# Altium project CoproMKII.PrjPcb
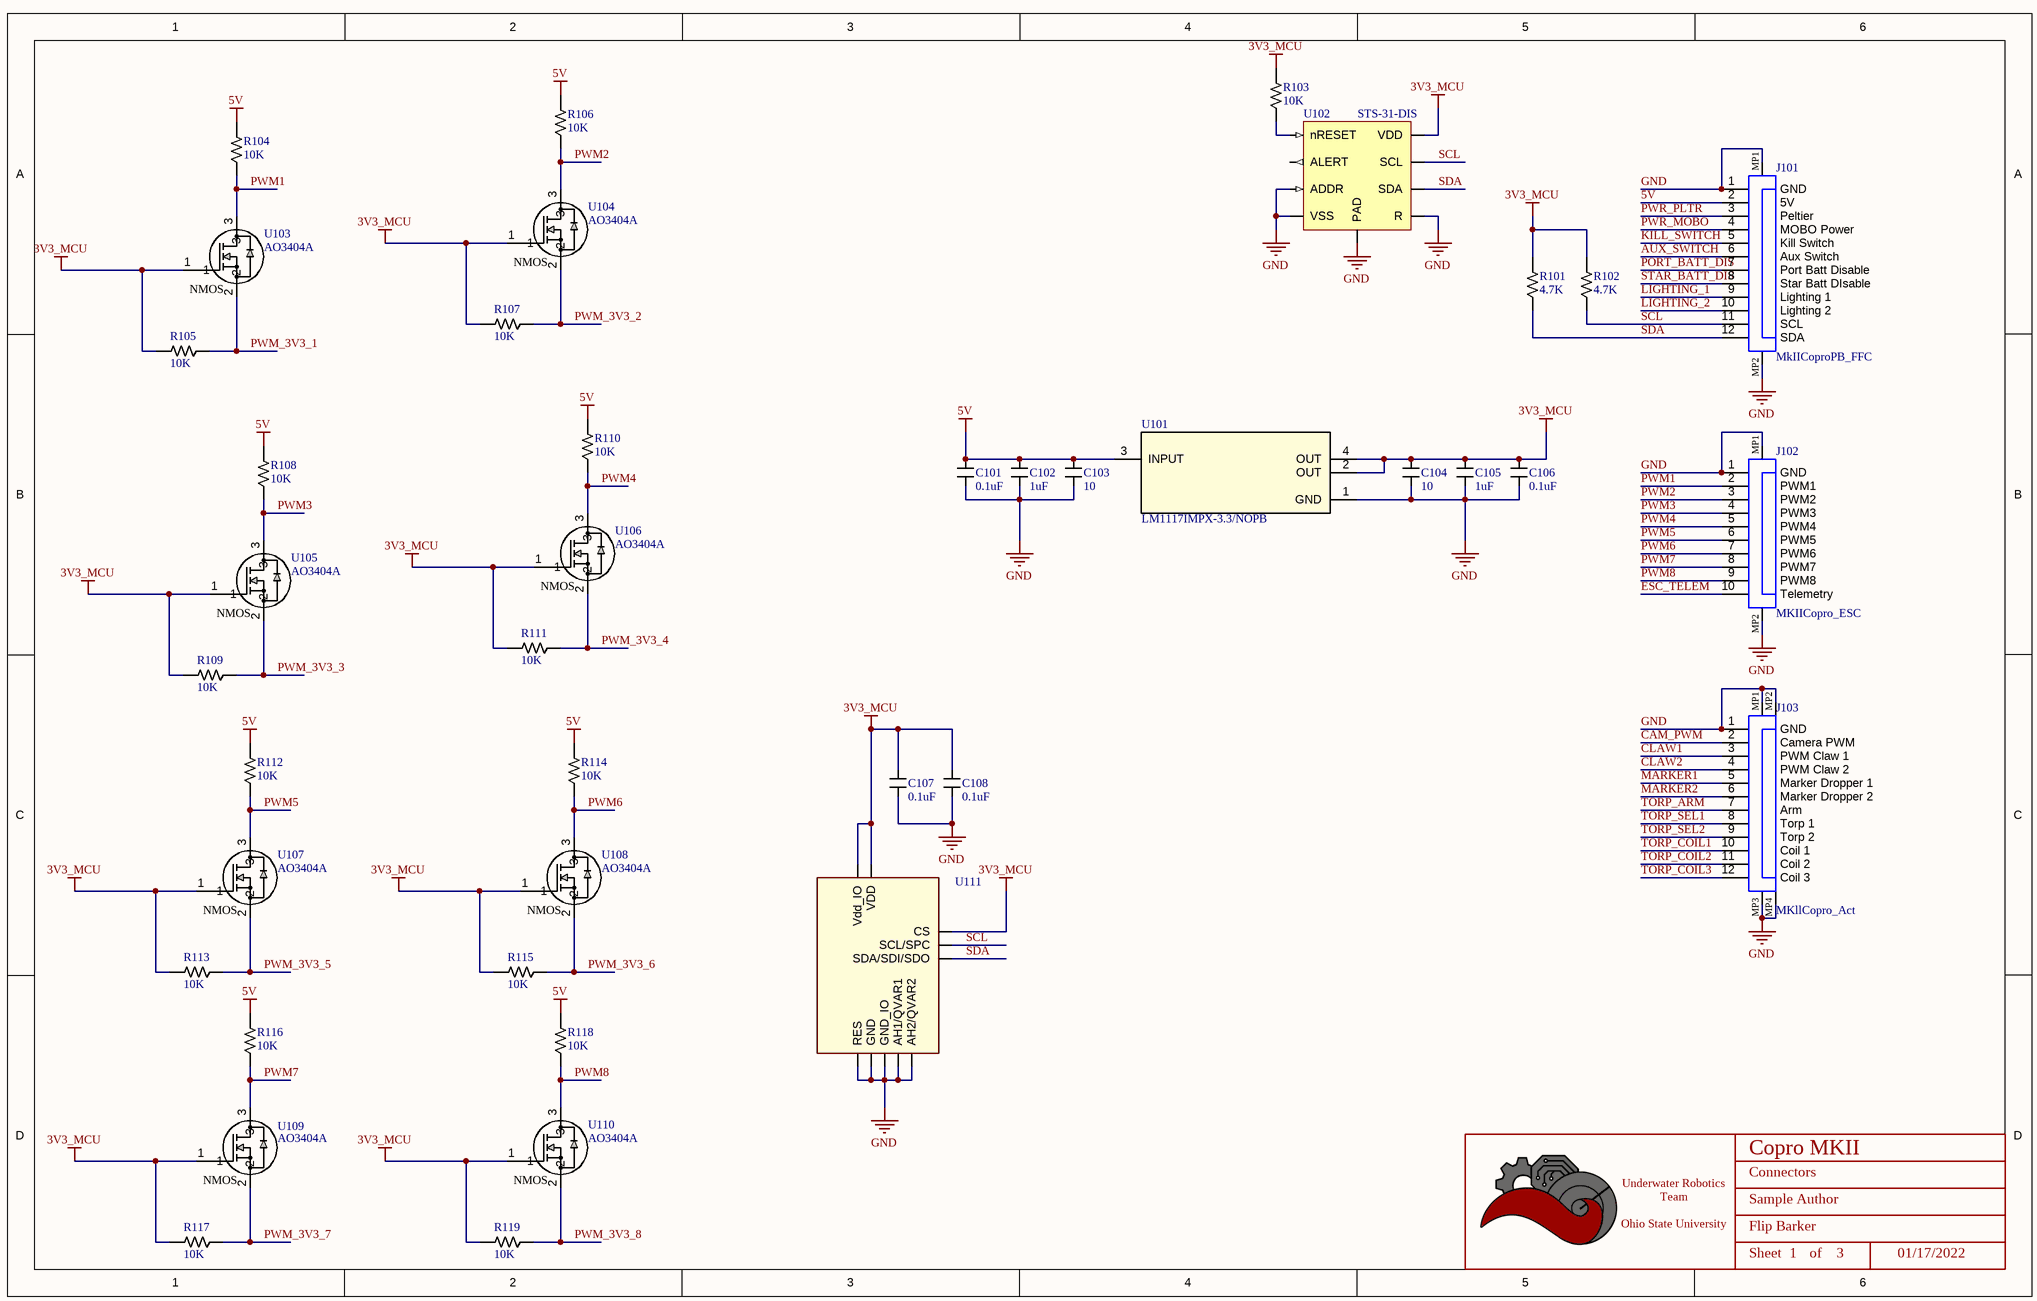
[diagram p0: CoproMKII_Connectors.SchDoc]
BoardRevision: 1.0; DateOfDesignReview: XX/XX/XXXX; ProjectTitle: Copro MKII; TeamLead: Flip Barker
4 sheets, 169 parts. Net scope: global (net labels, ports and power ports of the same name join across sheets).
Board file: CoproMKII.PcbDoc
Sheets:
  CoproMKII_Connectors.SchDoc
  CoproMKII_Coprocessor.SchDoc
  CoproMKII_Actuator.SchDoc
  CoproMKII_Ethernet.SchDoc

## Sheet CoproMKII_Connectors.SchDoc: Connectors
size B; Date: 01/17/2022; Author: Sample Author; Organization: ORGANIZATION; Address1: ADDRESS 1; Address2: ADDRESS 2; Address3: ADDRESS 3; Address4: ADDRESS 4; Revision: -; SheetNumber: 1; SheetTotal: 3; ENG_APP_DATE: --/--/--; DSN_APP_DATE: --/--/--; CHK_APP_DATE: --/--/--

### Parts
(Parts that share a designator on the sheet are numbered #1, #2 ... from top to bottom, then left to right.)
*#1  Title_Block  [LOGO]  (value not drawn)  (graphical)
C101  value 0.1uF  [CAPACITOR_0603]  (hidden comment: 100nF Ceramic 6.3V)
C102  value 1uF  [CAPACITOR_0603]  (hidden comment: 1uF Ceramic 16V)
C103  Value (uF): 10  [CAPACITOR_0603]  (hidden comment: 10uF Ceramic 6.3V)
C104  Value (uF): 10  [CAPACITOR_0603]  (hidden comment: 10uF Ceramic 6.3V)
C105  value 1uF  [CAPACITOR_0603]  (hidden comment: 1uF Ceramic 16V)
C106  value 0.1uF  [CAPACITOR_0603]  (hidden comment: 100nF Ceramic 6.3V)
C107  value 0.1uF  [CAPACITOR_0603]  (hidden comment: 100nF Ceramic 6.3V)
C108  value 0.1uF  [CAPACITOR_0603]  (hidden comment: 100nF Ceramic 6.3V)
J101  MkIICoproPB_FFC  [68611214122]
J102  MKIICopro_ESC  [68611014122]
J103  MKllCopro_Act  [686112183822]
R101  Value  (Ohms): 4.7K  [RESISTOR_0805]  (hidden comment: 4.7k Ohm 5% 1/8W)
R102  Value  (Ohms): 4.7K  [RESISTOR_0805]  (hidden comment: 4.7k Ohm 5% 1/8W)
R103  Value  (Ohms): 10K  [RESISTOR_0603]  (hidden comment: 10k Ohm 5% 1/10W)
R104  Value  (Ohms): 10K  [RESISTOR_0603]  (hidden comment: 10k Ohm 5% 1/10W)
R105  Value  (Ohms): 10K  [RESISTOR_0603]  (hidden comment: 10k Ohm 5% 1/10W)
R106  Value  (Ohms): 10K  [RESISTOR_0603]  (hidden comment: 10k Ohm 5% 1/10W)
R107  Value  (Ohms): 10K  [RESISTOR_0603]  (hidden comment: 10k Ohm 5% 1/10W)
R108  Value  (Ohms): 10K  [RESISTOR_0603]  (hidden comment: 10k Ohm 5% 1/10W)
R109  Value  (Ohms): 10K  [RESISTOR_0603]  (hidden comment: 10k Ohm 5% 1/10W)
R110  Value  (Ohms): 10K  [RESISTOR_0603]  (hidden comment: 10k Ohm 5% 1/10W)
R111  Value  (Ohms): 10K  [RESISTOR_0603]  (hidden comment: 10k Ohm 5% 1/10W)
R112  Value  (Ohms): 10K  [RESISTOR_0603]  (hidden comment: 10k Ohm 5% 1/10W)
R113  Value  (Ohms): 10K  [RESISTOR_0603]  (hidden comment: 10k Ohm 5% 1/10W)
R114  Value  (Ohms): 10K  [RESISTOR_0603]  (hidden comment: 10k Ohm 5% 1/10W)
R115  Value  (Ohms): 10K  [RESISTOR_0603]  (hidden comment: 10k Ohm 5% 1/10W)
R116  Value  (Ohms): 10K  [RESISTOR_0603]  (hidden comment: 10k Ohm 5% 1/10W)
R117  Value  (Ohms): 10K  [RESISTOR_0603]  (hidden comment: 10k Ohm 5% 1/10W)
R118  Value  (Ohms): 10K  [RESISTOR_0603]  (hidden comment: 10k Ohm 5% 1/10W)
R119  Value  (Ohms): 10K  [RESISTOR_0603]  (hidden comment: 10k Ohm 5% 1/10W)
U101  LM1117IMPX-3.3/NOPB  [SOT-223-4]
U102  STS-31-DIS  [8-TDFN]
U103  AO3404A  [SOT-23-3]
U104  AO3404A  [SOT-23-3]
U105  AO3404A  [SOT-23-3]
U106  AO3404A  [SOT-23-3]
U107  AO3404A  [SOT-23-3]
U108  AO3404A  [SOT-23-3]
U109  AO3404A  [SOT-23-3]
U110  AO3404A  [SOT-23-3]
U111  ILPS22QSTR  [LGA10R50P2X3_200X200X80]  (value not drawn)

### Nets
3V3_MCU: C104.1 C105.1 C106.1 C107.1 C108.1 R101.1 R102.1 R103.1 R105.1 R107.1 R109.1 R111.1 R113.1 R115.1 R117.1 R119.1 U101.2(OUT) U101.4(OUT) U102.5(VDD) U103.1 U104.1 U105.1 U106.1 U107.1 U108.1 U109.1 U110.1 U111.1(Vdd_IO) U111.6(CS) U111.10(VDD)
5V: C101.1 C102.1 C103.1 J101.2(5V) R104.1 R106.1 R108.1 R110.1 R112.1 R114.1 R116.1 R118.1 U101.3(INPUT)
GND: C101.2 C102.2 C103.2 C104.2 C105.2 C106.2 C107.2 C108.2 J101.1(GND) J101.MP1 J101.MP2 J102.1(GND) J102.MP1 J102.MP2 J103.1(GND) J103.MP1 J103.MP2 J103.MP3 J103.MP4 U101.1(GND) U102.2(ADDR) U102.7(R) U102.8(VSS) U102.9(PAD) U111.3(RES) U111.5(AH2/QVAR2) U111.7(AH1/QVAR1) U111.8(GND_IO) U111.9(GND)
AUX_SWITCH: J101.6(Aux_Switch)
CAM_PWM: J103.2(Camera_PWM)
CLAW1: J103.3(PWM_Claw_1)
CLAW2: J103.4(PWM_Claw_2)
ESC_TELEM: J102.10(Telemetry)
KILL_SWITCH: J101.5(Kill_Switch)
LIGHTING_1: J101.9(Lighting_1)
LIGHTING_2: J101.10(Lighting_2)
MARKER1: J103.5(Marker_Dropper_1)
MARKER2: J103.6(Marker_Dropper_2)
PORT_BATT_DIS: J101.7(Port_Batt_Disable)
PWM1: J102.2(PWM1) R104.2 U103.3
PWM2: J102.3(PWM2) R106.2 U104.3
PWM3: J102.4(PWM3) R108.2 U105.3
PWM4: J102.5(PWM4) R110.2 U106.3
PWM5: J102.6(PWM5) R112.2 U107.3
PWM6: J102.7(PWM6) R114.2 U108.3
PWM7: J102.8(PWM7) R116.2 U109.3
PWM8: J102.9(PWM8) R118.2 U110.3
PWM_3V3_1: R105.2 U103.2
PWM_3V3_2: R107.2 U104.2
PWM_3V3_3: R109.2 U105.2
PWM_3V3_4: R111.2 U106.2
PWM_3V3_5: R113.2 U107.2
PWM_3V3_6: R115.2 U108.2
PWM_3V3_7: R117.2 U109.2
PWM_3V3_8: R119.2 U110.2
PWR_MOBO: J101.4(MOBO_Power)
PWR_PLTR: J101.3(Peltier)
SCL: J101.11(SCL) R102.2 U102.4(SCL) U111.2(SCL/SPC)
SDA: J101.12(SDA) R101.2 U102.1(SDA) U111.4(SDA/SDI/SDO)
STAR_BATT_DIS: J101.8(Star_Batt_DIsable)
TORP_ARM: J103.7(Arm)
TORP_COIL1: J103.10(Coil_1)
TORP_COIL2: J103.11(Coil_2)
TORP_COIL3: J103.12(Coil_3)
TORP_SEL1: J103.8(Torp_1)
TORP_SEL2: J103.9(Torp_2)
NetR103_2: R103.2 U102.6(nRESET)

Not connected (* = marked no-connect by the designer): U102 3(ALERT)

### Notes on the sheet
- DWG. NO.
- REV.
- SHT.
- THIS DOCUMENT AND THE DATA DISCLOSED HEREIN OR HEREWITH IS THE PROPERTY OF ALTIUM LIMITED AND MAY BE FREELY DISTRIBUTED IN WHOLE. NO RIGHTS ARE RESERVED OR EXPRESS OR IMPLIED WARANTEE GIVEN.
- REVISION
- DESCRIPTION
- DATE
- APPROVED
- ENG:
- APPROVALS
- PROJECT
- DSN:
- CHK:
- REFERENCE DOCUMENTS
- PROJECT REVISION:
- TITLE
- DOCUMENT REVISION:
- DESIGN ITEM:
- BOM:
- FAB DWG:
- PCB DWG:
- ASSY DWG:
- SCALE:
- SIZE
- B
- CAGE CODE
- FILE NAME
- DWG NO.
- SHEET
- OF
- REV
- (in symbol AO3404A) NMOS
- (in symbol Title_Block) Underwater Robotics Team / Ohio State University; Sheet; of

### Library data of the parts
*#1 = Title_Block: UWRT Schematic Title Block Template / Created June 2021, Dylan Trainor
C101 C106-C108 = CAPACITOR_0.1uF_0603: Cap 100nF 6.3V +/-10% / Ceramic 0603; Made By: Flip B; ComponentLink1Description: Datsheet; ComponentLink1URL: https://www.mouser.com/datasheet/2/212/KEM_C1002_X7R_SMD-1102033.pdf; Tolerance: +/- 10%; Voltage: 6.3V; Supplier 1: Digi-Key; Supplier Part Number 1: 399-15351-1-ND
C102 C105 = CAPACITOR_1uF_0603: Cap 1uF 16V +/-10% / Ceramic 0603; Made By: Flip B; Tolerance: +/- 10%; Voltage: 16V; Supplier 1: Digi-Key; Supplier Part Number 1: 399-7847-1-ND
C103 C104 = CAPACITOR_10uF_0603: Cap 10uF 6.3V +/-20% / Ceramic 0603; Made By: Flip B; ComponentLink1Description: Digikey; ComponentLink1URL: https://www.digikey.com/en/products/detail/samsung-electro-mechanics/CL10A106MQ8NNNC/3886777; Supplier 1: Digi-Key; Supplier Part Number 1: 1276-1119-1-ND; Tolerance: +/- 20%; Voltage: 6.3V
J101 = MkIICoproPB_FFC: WR-FPC SMT ZIF Horizontal Top Contact, pitch 1mm, 12p; Manufacturer: Wurth Elektronik; Contact Resistance: 20mOhm; Pin Number: 12; Working Voltage: 125VAC; Rated Current: 1A; ComponentLink1Description: Manufacturer; ComponentLink1URL: http://www.we-online.de; ComponentLink2Description: Datasheet; ComponentLink2URL: https://katalog.we-online.com/em/datasheet/68611214122.pdf; Packaging: Tape and Reel; Pitch: 1mm; Published Date: March 2021; Mounting Technology: SMT; Operating Temperature: -25 to +85degC; Length: 19mm; Manufacturer Part Number: 68611214122; Type: Horizontal
J102 = MKIICopro_ESC: WR-FPC SMT ZIF Horizontal Top Contact, pitch 1mm, 10p; Manufacturer: Wurth Elektronik; Contact Resistance: 20mOhm; Pin Number: 10; Working Voltage: 125VAC; Rated Current: 1A; ComponentLink1Description: Manufacturer; ComponentLink1URL: http://www.we-online.de; ComponentLink2Description: Datasheet; ComponentLink2URL: https://katalog.we-online.com/em/datasheet/68611014122.pdf; Packaging: Tape and Reel; Pitch: 1mm; Published Date: March 2021; Mounting Technology: SMT; Operating Temperature: -25 to +85degC; Length: 17mm; Manufacturer Part Number: 68611014122; Type: Horizontal
J103 = MKllCopro_Act: WR-FPC SMT ZIF Vertical Type A, pitch 1mm, 12p; Manufacturer: Wurth Elektronik; Contact Resistance: 30mOhm; Pin Number: 12; Working Voltage: 125VAC; Rated Current: 1A; ComponentLink1Description: Manufacturer; ComponentLink1URL: http://www.we-online.de; ComponentLink2Description: Datasheet; ComponentLink2URL: https://katalog.we-online.com/em/datasheet/686112183822.pdf; Packaging: Tape and Reel; Pitch: 1mm; Published Date: March 2021; Mounting Technology: SMT; Operating Temperature: -25 to +85degC; Length: 18.8mm; Manufacturer Part Number: 686112183822; Type: Vertical
R101 R102 = RESISTOR_4.7K_0805: RES 4.7k OHM 5% 1/8W 0805; Tolerance: +/- 5%; Made By: Robert Pafford; ComponentLink1Description: Datasheet; Wattage: 1/8W; Supplier: Digikey; Digikey Part Numer: CR0603-JW-104ELFTR-ND
R103-R119 = RESISTOR_10K_0603: RES 10k OHM 5% 1/10W 0603; Tolerance: +/- 5%; Wattage: 1/8W; Made By: Robert Pafford; ComponentLink1Description: Datasheet; ComponentLink1URL: https://www.bourns.com/docs/product-datasheets/CRxxxxx.pdf; Supplier: Digikey; Digikey Part Numer: CR0603-JW-104ELFTR-ND; Supplier 1: Digi-Key; Supplier Part Number 1: 2019-RK73B1JTTD103JCT-ND
U101 = LM1117IMPX-3.3/NOPB: IC REG LIN 3.3V 800MA SOT223-4; PartNumber: LM1117IMP-3.3/NOPB; Manufacturer: Texas Instruments; Vin (Max): 15V; Supplier 1: Digi-Key; Supplier Part Number 1: LM1117IMPX-3.3/NOPBCT-ND; Vout (Min/Fixed): 3.3V; Amp Out: 800mA; Package: SOT-223-4; Created By: Dylan T
U102 = STS-31-DIS: Temperature Sensor Digital, Local 0°C ~ 90°C 16 b 8-TDFN (2.5x2.5); Accuracy: ±0.2°C; Operating Range: -40°C ~ 125°C; Interface: I2C; Resolution: 16b; Operating Voltage: 2.15V ~ 5.5V; Made By: Robert Pafford; Supplier 1: Digi-Key; Supplier Part Number 1: 1649-1064-1-ND; Accuracy Range: 0°C ~ 90°C
U103-U110 = AO3404A: N-Channel 30 V 5.8A (Ta) 1.4W (Ta) Surface Mount SOT-23-3; Vendor: Alpha & Omega Semiconductor Inc.; SourceLibrary: ON_Semiconductor_2020-01-13; Vgs (Max): 3V @ 5.8A, 10V; Vgs (th): 3V @ 250µA; Vdss: 30V; Rds (on): 28mOhm @ 5.8A, 10V; Amp Rating: 5.8 A; FET Type: N-Channel; Package: SOT23-3L; Manufacturer _Part_Number: AO3404A; Power Dissipation: 1.4W (Ta); Supplier 1: Digi-Key; Supplier Part Number 1: 785-1004-1-ND; Created By: Dylan T
U111 = ILPS22QSTR: Board Mount Pressure Sensors Dual full-scale 1260hPa 4060hPa absolute digital output barometer embedded Qvar. I2C and SPI; Supplier 1: Mouser; Supplier Part Number 1: 511-ILPS22QSTR

## Sheet CoproMKII_Coprocessor.SchDoc: Coprocessor MCU
size B; Date: MM/DD/YYYY; Author: John Speasmaker; Organization: ORGANIZATION; Address1: ADDRESS 1; Address2: ADDRESS 2; Address3: ADDRESS 3; Address4: ADDRESS 4; Revision: -; SheetNumber: 2; SheetTotal: 4; ENG_APP_DATE: --/--/--; DSN_APP_DATE: --/--/--; CHK_APP_DATE: --/--/--
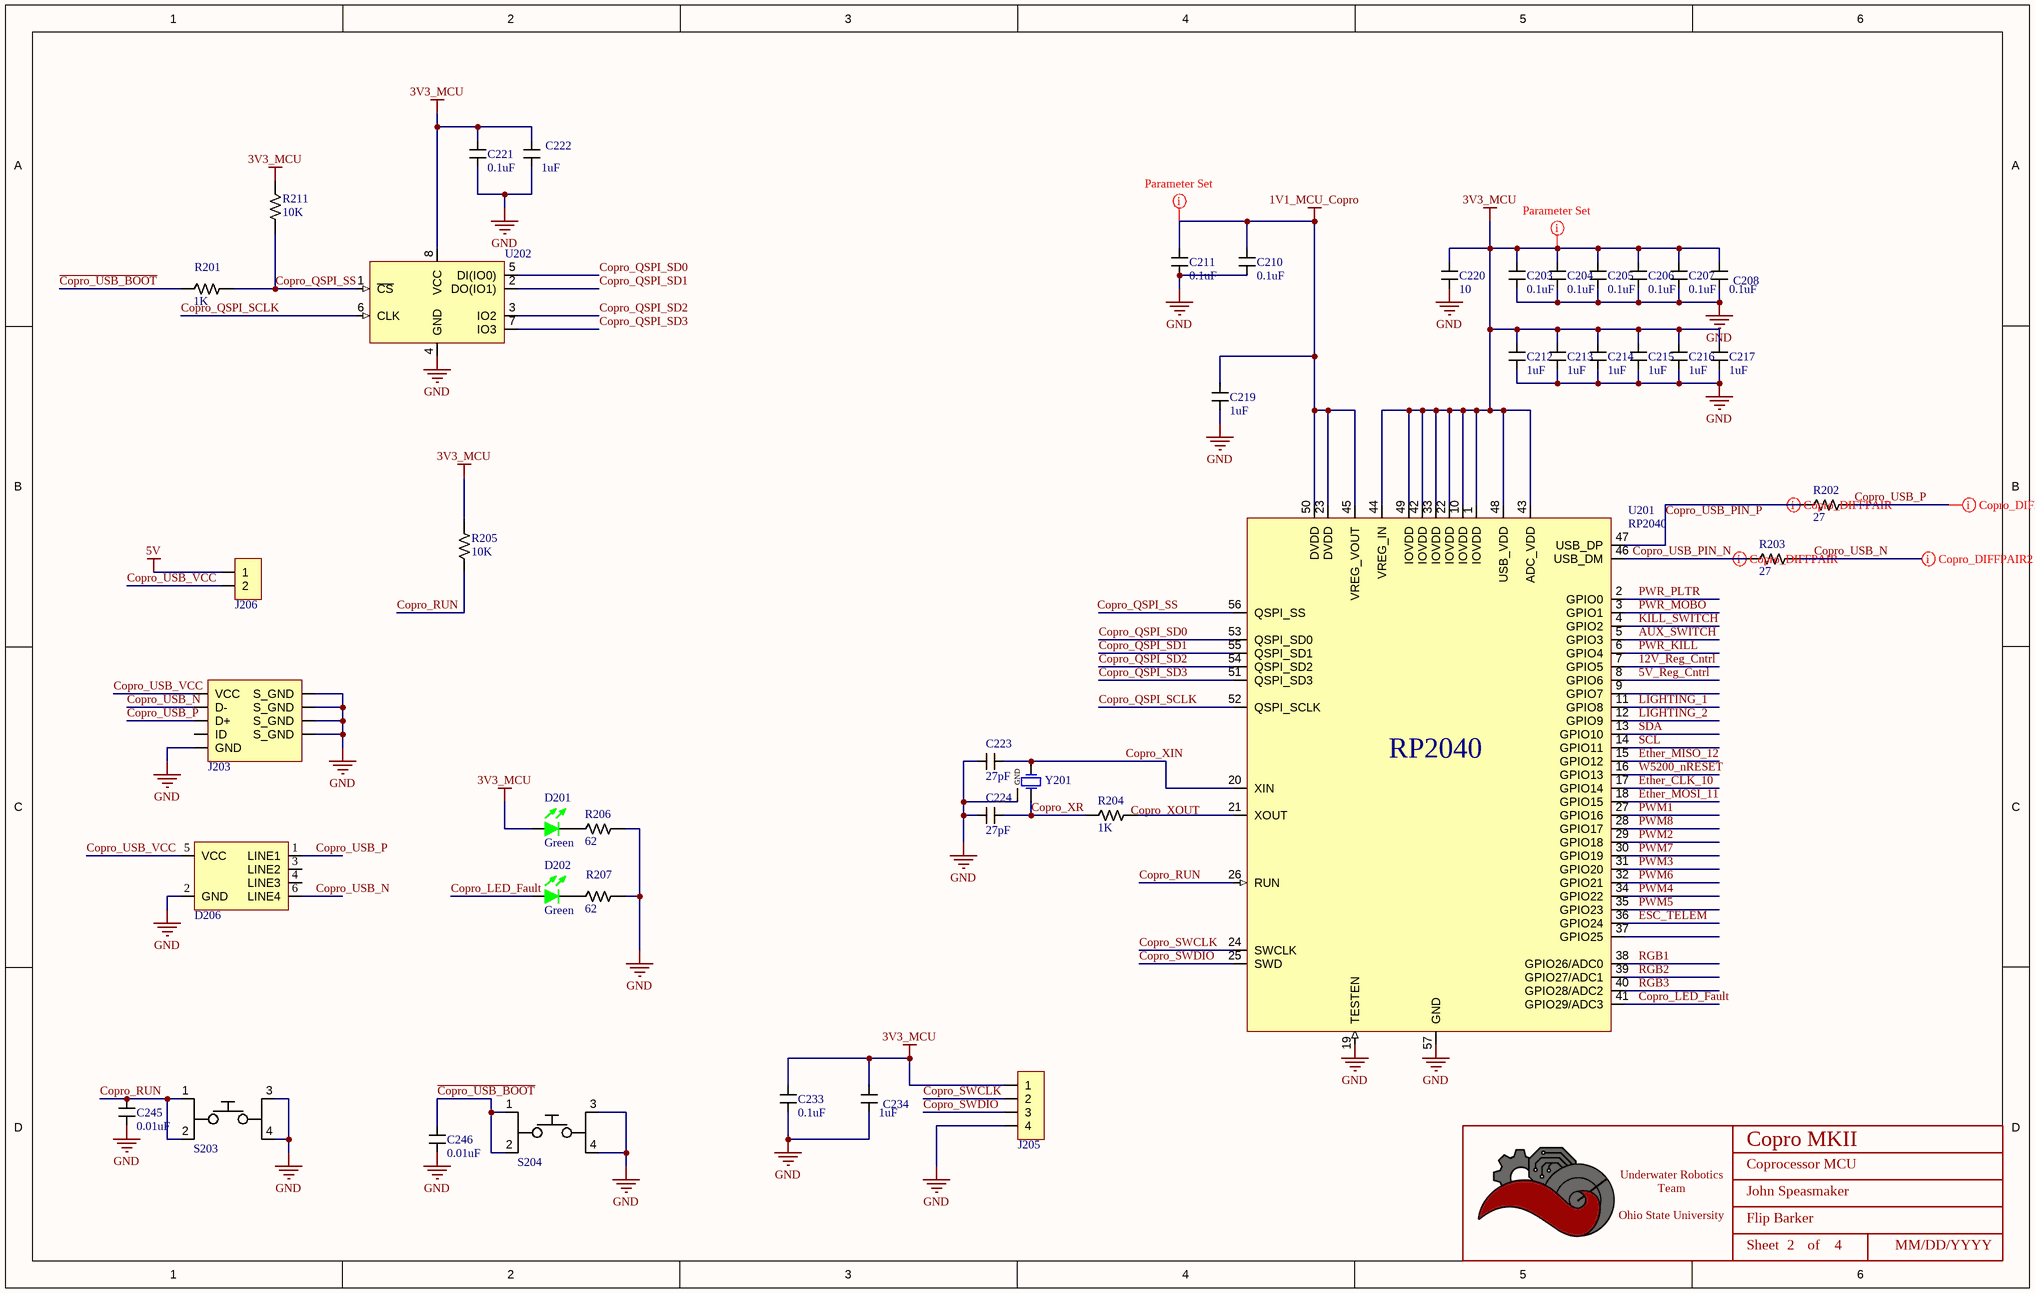
[diagram p1: CoproMKII_Coprocessor.SchDoc]

### Parts
(Parts that share a designator on the sheet are numbered #1, #2 ... from top to bottom, then left to right.)
*#2  Title_Block  [LOGO]  (value not drawn)  (graphical)
C203  value 0.1uF  [CAPACITOR_0603]  (hidden comment: 100nF Ceramic 6.3V)
C204  value 0.1uF  [CAPACITOR_0603]  (hidden comment: 100nF Ceramic 6.3V)
C205  value 0.1uF  [CAPACITOR_0603]  (hidden comment: 100nF Ceramic 6.3V)
C206  value 0.1uF  [CAPACITOR_0603]  (hidden comment: 100nF Ceramic 6.3V)
C207  value 0.1uF  [CAPACITOR_0603]  (hidden comment: 100nF Ceramic 6.3V)
C208  value 0.1uF  [CAPACITOR_0603]  (hidden comment: 100nF Ceramic 6.3V)
C210  value 0.1uF  [CAPACITOR_0603]  (hidden comment: 100nF Ceramic 6.3V)
C211  value 0.1uF  [CAPACITOR_0603]  (hidden comment: 100nF Ceramic 6.3V)
C212  value 1uF  [CAPACITOR_0603]  (hidden comment: 1uF Ceramic 16V)
C213  value 1uF  [CAPACITOR_0603]  (hidden comment: 1uF Ceramic 16V)
C214  value 1uF  [CAPACITOR_0603]  (hidden comment: 1uF Ceramic 16V)
C215  value 1uF  [CAPACITOR_0603]  (hidden comment: 1uF Ceramic 16V)
C216  value 1uF  [CAPACITOR_0603]  (hidden comment: 1uF Ceramic 16V)
C217  value 1uF  [CAPACITOR_0603]  (hidden comment: 1uF Ceramic 16V)
C219  value 1uF  [CAPACITOR_0603]  (hidden comment: 1uF Ceramic 16V)
C220  Value (uF): 10  [CAPACITOR_0603]  (hidden comment: 10uF Ceramic 6.3V)
C221  value 0.1uF  [CAPACITOR_0603]  (hidden comment: 100nF Ceramic 6.3V)
C222  value 1uF  [CAPACITOR_0603]  (hidden comment: 1uF Ceramic 16V)
C223  value 27pF  [CAPACITOR_0603]  (hidden comment: 27pF Ceramic 50V)
C224  value 27pF  [CAPACITOR_0603]  (hidden comment: 27pF Ceramic 50V)
C233  value 0.1uF  [CAPACITOR_0603]  (hidden comment: 100nF Ceramic 6.3V)
C234  value 1uF  [CAPACITOR_0603]  (hidden comment: 1uF Ceramic 16V)
C245  value 0.01uF  [CAPACITOR_0603]  (hidden comment: 10nF Ceramic 6.3V)
C246  value 0.01uF  [CAPACITOR_0603]  (hidden comment: 10nF Ceramic 6.3V)
D201  Color: Green  [LED_0603]  (hidden comment: IN-S63AT5G)
D202  Color: Green  [LED_0603]  (hidden comment: IN-S63AT5G)
D206  TVS DIODE 5VWM 25VC SOT23-6  [SOT 23-6L]  (value not drawn)
J203  USB_MICRO R/A  [CONN_MINIUSB]  (value not drawn)
J205  CONN HEADER VERT 4POS 2.54MM  [HEADER_4PIN_2.54MM]  (value not drawn)
J206  2 POS  [HEADER_2PIN_2.54MM]  (value not drawn)
R201  Value  (Ohms): 1K  [RESISTOR_0603]  (hidden comment: 1k Ohm 5% 1/8W)
R202  Value  (Ohms): 27  [RESISTOR_0603]  (hidden comment: 27 Ohm 5% 1/8W)
R203  Value  (Ohms): 27  [RESISTOR_0603]  (hidden comment: 27 Ohm 5% 1/8W)
R204  Value  (Ohms): 1K  [RESISTOR_0603]  (hidden comment: 1k Ohm 5% 1/8W)
R205  Value  (Ohms): 10K  [RESISTOR_0603]  (hidden comment: 10k Ohm 5% 1/10W)
R206  Value  (Ohms): 62  [RESISTOR_0603]  (hidden comment: 62 Ohm 1% 1/4W)
R207  Value  (Ohms): 62  [RESISTOR_0603]  (hidden comment: 62 Ohm 1% 1/4W)
R211  Value  (Ohms): 10K  [RESISTOR_0603]  (hidden comment: 10k Ohm 5% 1/10W)
S203  SPST Tactile Switch  [TactileSwitch]  (value not drawn)
S204  SPST Tactile Switch  [TactileSwitch]  (value not drawn)
U201  RP2040  [QFN-56 RP2040]
U202  W25Q128JVSIQ  [SOIC-8 W25QxJV]  (value not drawn)
Y201  CRYSTAL 12.0000MHZ 18PF SMD  [4-SMD No Lead Crystal]  (value not drawn)

### Nets
1V1_MCU_Copro: C210.2 C211.2 C219.2 U201.23(DVDD) U201.45(VREG_VOUT) U201.50(DVDD)
3V3_MCU: C203.2 C204.2 C205.2 C206.2 C207.2 C208.2 C212.2 C213.2 C214.2 C215.2 C216.2 C217.2 C220.2 C221.1 C222.1 C233.1 C234.1 D201.1 J205.1 R205.1 R211.2 U201.1(IOVDD) U201.10(IOVDD) U201.22(IOVDD) U201.33(IOVDD) U201.42(IOVDD) U201.43(ADC_VDD) U201.44(VREG_IN) U201.48(USB_VDD) U201.49(IOVDD) U202.8(VCC)
5V: J206.1
GND: C203.1 C204.1 C205.1 C206.1 C207.1 C208.1 C210.1 C211.1 C212.1 C213.1 C214.1 C215.1 C216.1 C217.1 C219.1 C220.1 C221.2 C222.2 C223.2 C224.2 C233.2 C234.2 C245.2 C246.2 D206.2(GND) J203.5(GND) J203.6(S_GND) J203.7(S_GND) J203.8(S_GND) J203.9(S_GND) J205.4 R206.1 R207.1 S203.3 S203.4 S204.3 S204.4 U201.19(TESTEN) U201.57(GND) U202.4(GND) Y201.GND
5V_Reg_Cntrl: U201.8(GPIO6)
12V_Reg_Cntrl: U201.7(GPIO5)
AUX_SWITCH: U201.5(GPIO3)
~{Copro_USB_BOOT}: C246.1 R201.2 S204.1 S204.2
Copro_LED_Fault: D202.1 U201.41(GPIO29/ADC3)
Copro_QSPI_SCLK: U201.52(QSPI_SCLK) U202.6(CLK)
Copro_QSPI_SD0: U201.53(QSPI_SD0) U202.5(DI(IO0))
Copro_QSPI_SD1: U201.55(QSPI_SD1) U202.2(DO(IO1))
Copro_QSPI_SD2: U201.54(QSPI_SD2) U202.3(IO2)
Copro_QSPI_SD3: U201.51(QSPI_SD3) U202.7(IO3)
Copro_QSPI_SS: R201.1 R211.1 U201.56(QSPI_SS) U202.1(~{CS})
Copro_RUN: C245.1 R205.2 S203.1 S203.2 U201.26(RUN)
Copro_SWCLK: J205.2 U201.24(SWCLK)
Copro_SWDIO: J205.3 U201.25(SWD)
Copro_USB_N: D206.6(LINE4) J203.2(D-) R203.1
Copro_USB_P: D206.1(LINE1) J203.3(D+) R202.1
Copro_USB_PIN_N: R203.2 U201.46(USB_DM)
Copro_USB_PIN_P: R202.2 U201.47(USB_DP)
Copro_USB_VCC: D206.5(VCC) J203.1(VCC) J206.2
Copro_XIN: C223.1 U201.20(XIN) Y201.1
Copro_XR: C224.1 R204.2 Y201.2
ESC_TELEM: U201.36(GPIO24)
Ether_CLK_10: U201.17(GPIO14)
Ether_MISO_12: U201.15(GPIO12)
Ether_MOSI_11: U201.18(GPIO15)
KILL_SWITCH: U201.4(GPIO2)
LIGHTING_1: U201.11(GPIO8)
LIGHTING_2: U201.12(GPIO9)
PWM1: U201.27(GPIO16)
PWM2: U201.29(GPIO18)
PWM3: U201.31(GPIO20)
PWM4: U201.34(GPIO22)
PWM5: U201.35(GPIO23)
PWM6: U201.32(GPIO21)
PWM7: U201.30(GPIO19)
PWM8: U201.28(GPIO17)
PWR_KILL: U201.6(GPIO4)
PWR_MOBO: U201.3(GPIO1)
PWR_PLTR: U201.2(GPIO0)
RGB1: U201.38(GPIO26/ADC0)
RGB2: U201.39(GPIO27/ADC1)
RGB3: U201.40(GPIO28/ADC2)
SCL: U201.14(GPIO11)
SDA: U201.13(GPIO10)
W5200_nRESET: U201.16(GPIO13)
NetD201_2: D201.2 R206.2
NetD202_2: D202.2 R207.2
NetR204_1: R204.1 U201.21(XOUT)

Not connected (* = marked no-connect by the designer): D206 3(LINE2) 4(LINE3); J203 4(ID); U201 9(GPIO7) 37(GPIO25)

### Layout directives
rule Supply Nets [Voltage = 3.300]: 3V3_MCU
rule Supply Nets [Voltage = 1.100]: 1V1_MCU_Copro
differential pair; differential pair class USB 2.0: Copro_USB_N, Copro_USB_P, Copro_USB_PIN_N, Copro_USB_PIN_P

### Notes on the sheet
- Labels drawn without touching a wire or pin: Copro_XOUT
- DWG. NO.
- REV.
- SHT.
- THIS DOCUMENT AND THE DATA DISCLOSED HEREIN OR HEREWITH IS THE PROPERTY OF ALTIUM LIMITED AND MAY BE FREELY DISTRIBUTED IN WHOLE. NO RIGHTS ARE RESERVED OR EXPRESS OR IMPLIED WARANTEE GIVEN.
- REVISION
- DESCRIPTION
- DATE
- APPROVED
- ENG:
- APPROVALS
- PROJECT
- DSN:
- CHK:
- REFERENCE DOCUMENTS
- PROJECT REVISION:
- TITLE
- DOCUMENT REVISION:
- DESIGN ITEM:
- BOM:
- FAB DWG:
- PCB DWG:
- ASSY DWG:
- SCALE:
- SIZE
- B
- CAGE CODE
- FILE NAME
- DWG NO.
- SHEET
- OF
- REV
- (in symbol Title_Block) Underwater Robotics Team / Ohio State University; Sheet; of

### Library data of the parts
*#2 = Title_Block: as *#1 on sheet CoproMKII_Connectors
C203-C208 C210 C211 C221 C233 = CAPACITOR_0.1uF_0603: as C101 on sheet CoproMKII_Connectors; ComponentLink1Description: Datsheet; ComponentLink1URL: https://www.mouser.com/datasheet/2/212/KEM_C1002_X7R_SMD-1102033.pdf; Tolerance: +/- 10%; Voltage: 6.3V; Supplier 1: Digi-Key; Supplier Part Number 1: 399-15351-1-ND
C212-C217 C219 C222 C234 = CAPACITOR_1uF_0603: as C102 on sheet CoproMKII_Connectors; Tolerance: +/- 10%; Voltage: 16V; Supplier 1: Digi-Key; Supplier Part Number 1: 399-7847-1-ND
C220 = CAPACITOR_10uF_0603: as C103 on sheet CoproMKII_Connectors; ComponentLink1Description: Digikey; ComponentLink1URL: https://www.digikey.com/en/products/detail/samsung-electro-mechanics/CL10A106MQ8NNNC/3886777; Supplier 1: Digi-Key; Supplier Part Number 1: 1276-1119-1-ND; Tolerance: +/- 20%; Voltage: 6.3V
C223 C224 = CAPACITOR_0.000027uF_0603: Cap 27pF 50V +/-5% / Ceramic 0603; Made By: Flip B; ComponentLink1Description: Datsheet; ComponentLink1URL: https://www.mouser.com/datasheet/2/212/KEM_C1002_X7R_SMD-1102033.pdf; Tolerance: +/- 5%; Voltage: 50V; Supplier 1: Digi-Key; Supplier Part Number 1: 311-1063-1-ND
C245 C246 = CAPACITOR_0.01uF_0603: Cap 10nF 6.3V +/-20% / Ceramic 0603; Tolerance: +/- 10%; Made By: Flip B; ComponentLink1Description: Datsheet; ComponentLink1URL: https://www.mouser.com/datasheet/2/212/KEM_C1002_X7R_SMD-1102033.pdf; Voltage: 6.3V; Supplier 1: Mouser; Supplier Part Number 1: 80-C0603C103K9R
D201 D202 = LED_Green_0603_3V: LED Green Vf= 3V If = 0.005A / IN-S63AT5G; Made By: Robert Pafford; Forward Current: 5mA; ComponentLink1Description: Datasheet; ComponentLink1URL: https://www.we-online.de/katalog/datasheet/150060GS75000.pdf; Forward Voltage: 3V; Package: 0603; Supplier 1: Digi-Key; Supplier Part Number 1: 1830-1062-1-ND
D206 = RCLAMP0504S.TCT: 25V Clamp 6A (8/20µs) Ipp Tvs Diode Surface Mount SOT-23-6; Made By: Robert Pafford; Reverse Standoff Voltage (Typ): 5V; Breakdown Voltage (Min): 6V; Supplier 1: Digi-Key; Supplier Part Number 1: RCLAMP0504SCT-ND; Clamping Voltage (Max): 25V
J203 = CONN_MICROUSB: Amphenol Micro USB-B / USB2.0 5 Pin Right Angle SMD; Pitch: 0.65mm; Current Per Pin: 1.8A; Number of Positions: 5; Manufacturer: Amphenol; Configuration: Right Angle; Color: Silver; Created By: Flip B; ComponentLink1Description: Datasheet; ComponentLink1URL: https://cdn.amphenol-icc.com/media/wysiwyg/files/documentation/datasheet/inputoutput/io_usb_micro.pdf?__cf_chl_jschl_tk__=05693735e19256298f6ef6ca2bb2e65c376a4f56-1625503833-0-Abitsb0-ufjOXJYs_S3J3r2iTn-nObalbmXUksF1VvO_h_WEmRdMlUD1I8-hmWSEVWzY1pirKnrPZWfgY3851qyBZe5ZvnNQePLGIzUgdEIQBVUyW36RsbYpDLEWxJ4horD-5gChFgobLYqwmG5aHl0E8lIn_twwPPrOxilK2gP0q9t_CNOs_u5fMqXvXUrlsOv8tIE2NRlu6NVP8qtkL2GjhlkeTUbDMF8WvvpPDTFOgvZ4Y16Ej8F8AhWos88mo5B1HssXozw0XrkJQIqERITUu6rqloz9kf4ZzhBHtDAt-IkiAFY_Ds9SW8FYKKTtINJVpHZQ6Gyu1FFM4Dc9MO0maE8_mmNcwlxqyRoRk_MPWW8VyByXWM5RSp52jteRKw7FeI9WIYvCbPAOy0Eyib-aseIQsnGbglBcUY6_2xp8GYaJM38H3dNvBPsSOfJBPndKedwKHllxjkucXn6xsN0sDXkpGN-cu8_2bDTJ0g-uUucKSCooYX-ApSDNGpkA_p9zv1SOAD8c0zaZVmtiBsN75QpVz2rzq9_BFxOywPvR; Series: 10118192; Supplier 1: Digi-Key; Supplier Part Number 1: 609-4613-1-ND
J205 = HEADER_4PIN_2.54MM: Made By: Robert Pafford; Supplier 1: Digi-Key; Supplier Part Number 1: S1012E-04-ND
J206 = HEADER_2PIN_2.54MM: CONN HEADER VERT 2POS 2.54MM; Configuration: Vertical; Current Per Pin: 1A; Number of Positions: 2; Manufacturer: *; Pitch: 2.54mm; Color: Natural; Created By: Robert P; ComponentLink1Description: Datasheet; ComponentLink1URL: https://www.molex.com/pdm_docs/sd/026013115_sd.pdf; Series: *; Supplier 1: Digi-Key; Supplier Part Number 1: A121480-ND; Supplier 2: Mouser; Supplier Part Number 2: 571-5-146280-2
R201 R204 = RESISTOR_1K_0603: RES 1k OHM 5% 1/8W 0603; Tolerance: +/- 5%; Made By: Robert Pafford; ComponentLink1Description: Datasheet; ComponentLink1URL: https://www.bourns.com/docs/product-datasheets/CRxxxxx.pdf; Wattage: 1/8W; Supplier: Digikey; Digikey Part Numer: CR0603-JW-104ELFTR-ND; Supplier 1: Digi-Key; Supplier Part Number 1: 2019-RK73B1JTTD102JCT-ND
R202 R203 = RESISTOR_27_0603: RES 27 OHM 5% 1/8W 0603; Tolerance: +/- 5%; Made By: Robert Pafford; ComponentLink1Description: Datasheet; ComponentLink1URL: https://www.bourns.com/docs/product-datasheets/CRxxxxx.pdf; Wattage: 1/8W; Supplier: Digikey; Digikey Part Numer: CR0603-JW-104ELFTR-ND; Supplier 1: Digi-Key; Supplier Part Number 1: 2019-RK73B1JTTD270JCT-ND
R205 R211 = RESISTOR_10K_0603: as R103 on sheet CoproMKII_Connectors; ComponentLink1Description: Datasheet; ComponentLink1URL: https://www.bourns.com/docs/product-datasheets/CRxxxxx.pdf; Supplier: Digikey; Digikey Part Numer: CR0603-JW-104ELFTR-ND; Supplier 1: Digi-Key; Supplier Part Number 1: 2019-RK73B1JTTD103JCT-ND
R206 R207 = RESISTOR_62_0603: RES SMD 62 OHM 1% 1/4W 0603; Tolerance: +/- 1%; Made By: Robert Pafford; ComponentLink1Description: Datasheet; ComponentLink1URL: https://www.bourns.com/docs/product-datasheets/CRxxxxx.pdf; Wattage: 1/4W; Supplier: Digikey; Digikey Part Numer: CR0603-JW-104ELFTR-ND; Supplier 1: Digi-Key; Supplier Part Number 1: 541-RCS060362R0FKEACT-ND
S203 S204 = Tactile Switch: SWITCH TACTILE SPST-NO 0.05A 12V; Made By: Robert Pafford; Supplier 1: Digi-Key; Supplier Part Number 1: EG2494-ND
U201 = RP2040: Raspberry Pi RP2040; Made By: Robert Pafford; Input Voltage: 3.3V; Crystal Frequency: 12 MHz; Number of GPIOs: 29; Available Busses: SPI, I2C, PWM, USB; ComponentLink1Description: DigiKey; ComponentLink1URL: *; ComponentLink2Description: Datasheet; ComponentLink2URL: https://datasheets.raspberrypi.org/rp2040/rp2040-datasheet.pdf
U202 = W25Q128JVSIQ: IC FLASH 128MBIT SPI/QUAD 8SOIC; Made By: Robert Pafford; Supplier 1: Digi-Key; Supplier Part Number 1: W25Q128JVSIQ-ND; Size: 128M
Y201 = CRYSTAL_12MHz_SMD: 12 MHz ±20ppm Crystal 18pF 50 Ohms 4-SMD, No Lead; pin to pad: 2>3 GND>2+4; Made By: Siddharth Venkatesan; Frequency: 25 MHz; ESR: 40 Ohms; Load Capacitance: 18pF; Supplier 1: Digi-Key; Supplier Part Number 1: XC2312CT-ND

## Sheet CoproMKII_Actuator.SchDoc: Actuator MCU
size B; Date: MM/DD/YYYY; Author: Sample Author; Organization: ORGANIZATION; Address1: ADDRESS 1; Address2: ADDRESS 2; Address3: ADDRESS 3; Address4: ADDRESS 4; Revision: -; SheetNumber: 3; SheetTotal: 3; ENG_APP_DATE: --/--/--; DSN_APP_DATE: --/--/--; CHK_APP_DATE: --/--/--
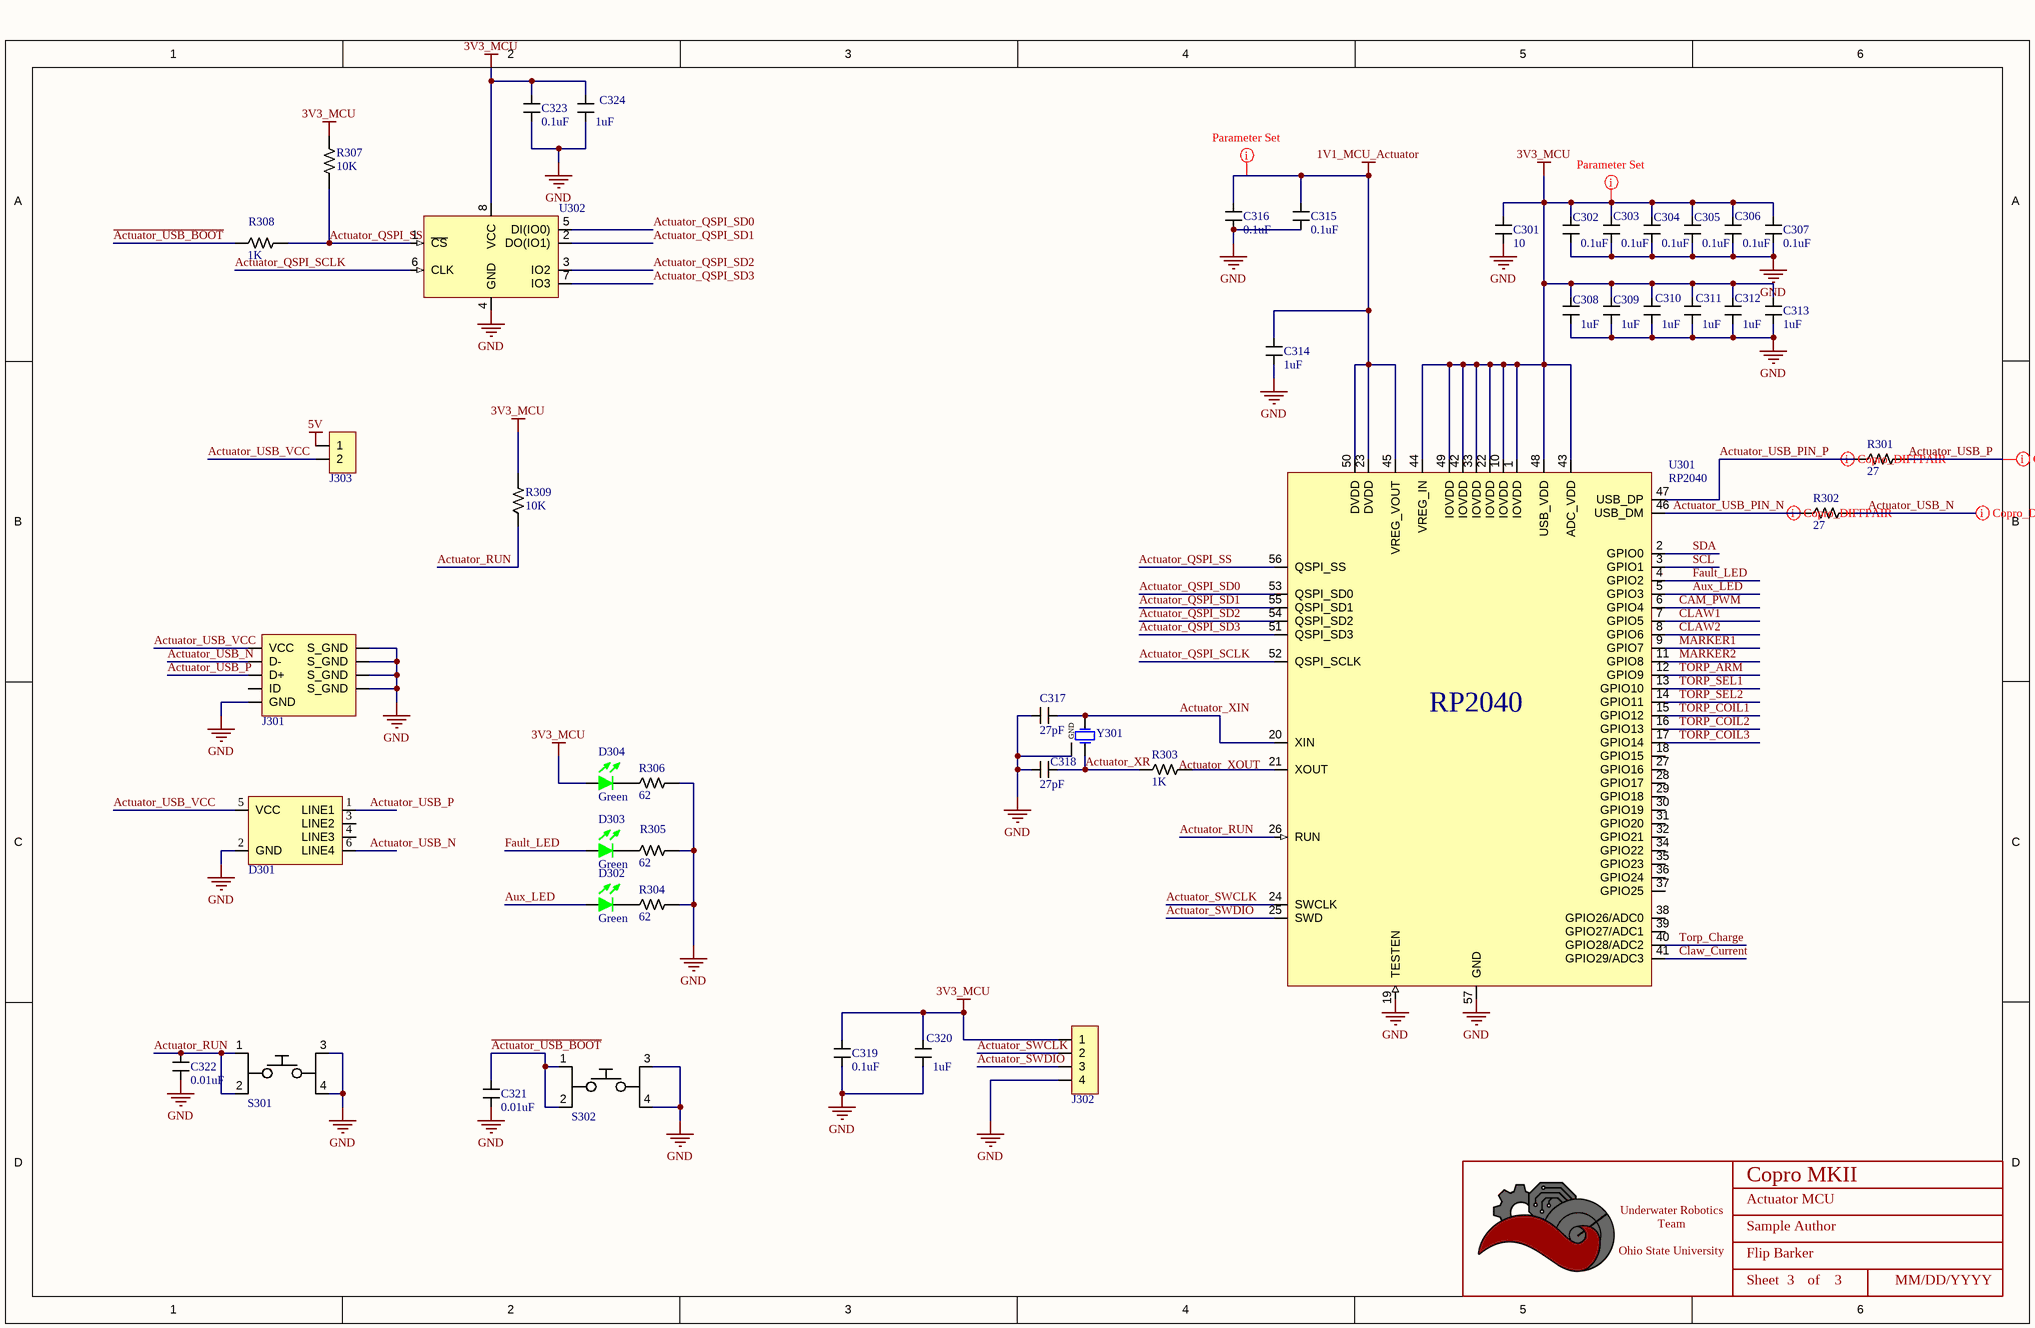
[diagram p2: CoproMKII_Actuator.SchDoc]

### Parts
(Parts that share a designator on the sheet are numbered #1, #2 ... from top to bottom, then left to right.)
*#3  Title_Block  [LOGO]  (value not drawn)  (graphical)
C301  Value (uF): 10  [CAPACITOR_0603]  (hidden comment: 10uF Ceramic 6.3V)
C302  value 0.1uF  [CAPACITOR_0603]  (hidden comment: 100nF Ceramic 6.3V)
C303  value 0.1uF  [CAPACITOR_0603]  (hidden comment: 100nF Ceramic 6.3V)
C304  value 0.1uF  [CAPACITOR_0603]  (hidden comment: 100nF Ceramic 6.3V)
C305  value 0.1uF  [CAPACITOR_0603]  (hidden comment: 100nF Ceramic 6.3V)
C306  value 0.1uF  [CAPACITOR_0603]  (hidden comment: 100nF Ceramic 6.3V)
C307  value 0.1uF  [CAPACITOR_0603]  (hidden comment: 100nF Ceramic 6.3V)
C308  value 1uF  [CAPACITOR_0603]  (hidden comment: 1uF Ceramic 16V)
C309  value 1uF  [CAPACITOR_0603]  (hidden comment: 1uF Ceramic 16V)
C310  value 1uF  [CAPACITOR_0603]  (hidden comment: 1uF Ceramic 16V)
C311  value 1uF  [CAPACITOR_0603]  (hidden comment: 1uF Ceramic 16V)
C312  value 1uF  [CAPACITOR_0603]  (hidden comment: 1uF Ceramic 16V)
C313  value 1uF  [CAPACITOR_0603]  (hidden comment: 1uF Ceramic 16V)
C314  value 1uF  [CAPACITOR_0603]  (hidden comment: 1uF Ceramic 16V)
C315  value 0.1uF  [CAPACITOR_0603]  (hidden comment: 100nF Ceramic 6.3V)
C316  value 0.1uF  [CAPACITOR_0603]  (hidden comment: 100nF Ceramic 6.3V)
C317  value 27pF  [CAPACITOR_0603]  (hidden comment: 27pF Ceramic 50V)
C318  value 27pF  [CAPACITOR_0603]  (hidden comment: 27pF Ceramic 50V)
C319  value 0.1uF  [CAPACITOR_0603]  (hidden comment: 100nF Ceramic 6.3V)
C320  value 1uF  [CAPACITOR_0603]  (hidden comment: 1uF Ceramic 16V)
C321  value 0.01uF  [CAPACITOR_0603]  (hidden comment: 10nF Ceramic 6.3V)
C322  value 0.01uF  [CAPACITOR_0603]  (hidden comment: 10nF Ceramic 6.3V)
C323  value 0.1uF  [CAPACITOR_0603]  (hidden comment: 100nF Ceramic 6.3V)
C324  value 1uF  [CAPACITOR_0603]  (hidden comment: 1uF Ceramic 16V)
D301  TVS DIODE 5VWM 25VC SOT23-6  [SOT 23-6L]  (value not drawn)
D302  Color: Green  [LED_0603]  (hidden comment: IN-S63AT5G)
D303  Color: Green  [LED_0603]  (hidden comment: IN-S63AT5G)
D304  Color: Green  [LED_0603]  (hidden comment: IN-S63AT5G)
J301  USB_MICRO R/A  [CONN_MINIUSB]  (value not drawn)
J302  CONN HEADER VERT 4POS 2.54MM  [HEADER_4PIN_2.54MM]  (value not drawn)
J303  2 POS  [HEADER_2PIN_2.54MM]  (value not drawn)
R301  Value  (Ohms): 27  [RESISTOR_0603]  (hidden comment: 27 Ohm 5% 1/8W)
R302  Value  (Ohms): 27  [RESISTOR_0603]  (hidden comment: 27 Ohm 5% 1/8W)
R303  Value  (Ohms): 1K  [RESISTOR_0603]  (hidden comment: 1k Ohm 5% 1/8W)
R304  Value  (Ohms): 62  [RESISTOR_0603]  (hidden comment: 62 Ohm 1% 1/4W)
R305  Value  (Ohms): 62  [RESISTOR_0603]  (hidden comment: 62 Ohm 1% 1/4W)
R306  Value  (Ohms): 62  [RESISTOR_0603]  (hidden comment: 62 Ohm 1% 1/4W)
R307  Value  (Ohms): 10K  [RESISTOR_0603]  (hidden comment: 10k Ohm 5% 1/10W)
R308  Value  (Ohms): 1K  [RESISTOR_0603]  (hidden comment: 1k Ohm 5% 1/8W)
R309  Value  (Ohms): 10K  [RESISTOR_0603]  (hidden comment: 10k Ohm 5% 1/10W)
S301  SPST Tactile Switch  [TactileSwitch]  (value not drawn)
S302  SPST Tactile Switch  [TactileSwitch]  (value not drawn)
U301  RP2040  [QFN-56 RP2040]
U302  W25Q128JVSIQ  [SOIC-8 W25QxJV]  (value not drawn)
Y301  CRYSTAL 12.0000MHZ 18PF SMD  [4-SMD No Lead Crystal]  (value not drawn)

### Nets
1V1_MCU_Actuator: C314.2 C315.2 C316.2 U301.23(DVDD) U301.45(VREG_VOUT) U301.50(DVDD)
3V3_MCU: C301.2 C302.2 C303.2 C304.2 C305.2 C306.2 C307.2 C308.2 C309.2 C310.2 C311.2 C312.2 C313.2 C319.1 C320.1 C323.1 C324.1 D304.1 J302.1 R307.2 R309.1 U301.1(IOVDD) U301.10(IOVDD) U301.22(IOVDD) U301.33(IOVDD) U301.42(IOVDD) U301.43(ADC_VDD) U301.44(VREG_IN) U301.48(USB_VDD) U301.49(IOVDD) U302.8(VCC)
5V: J303.1
GND: C301.1 C302.1 C303.1 C304.1 C305.1 C306.1 C307.1 C308.1 C309.1 C310.1 C311.1 C312.1 C313.1 C314.1 C315.1 C316.1 C317.2 C318.2 C319.2 C320.2 C321.2 C322.2 C323.2 C324.2 D301.2(GND) J301.5(GND) J301.6(S_GND) J301.7(S_GND) J301.8(S_GND) J301.9(S_GND) J302.4 R304.1 R305.1 R306.1 S301.3 S301.4 S302.3 S302.4 U301.19(TESTEN) U301.57(GND) U302.4(GND) Y301.GND
~{Actuator_USB_BOOT}: C321.1 R308.2 S302.1 S302.2
Actuator_QSPI_SCLK: U301.52(QSPI_SCLK) U302.6(CLK)
Actuator_QSPI_SD0: U301.53(QSPI_SD0) U302.5(DI(IO0))
Actuator_QSPI_SD1: U301.55(QSPI_SD1) U302.2(DO(IO1))
Actuator_QSPI_SD2: U301.54(QSPI_SD2) U302.3(IO2)
Actuator_QSPI_SD3: U301.51(QSPI_SD3) U302.7(IO3)
Actuator_QSPI_SS: R307.1 R308.1 U301.56(QSPI_SS) U302.1(~{CS})
Actuator_RUN: C322.1 R309.2 S301.1 S301.2 U301.26(RUN)
Actuator_SWCLK: J302.2 U301.24(SWCLK)
Actuator_SWDIO: J302.3 U301.25(SWD)
Actuator_USB_N: D301.6(LINE4) J301.2(D-) R302.1
Actuator_USB_P: D301.1(LINE1) J301.3(D+) R301.1
Actuator_USB_PIN_N: R302.2 U301.46(USB_DM)
Actuator_USB_PIN_P: R301.2 U301.47(USB_DP)
Actuator_USB_VCC: D301.5(VCC) J301.1(VCC) J303.2
Actuator_XIN: C317.1 U301.20(XIN) Y301.1
Actuator_XR: C318.1 R303.2 Y301.2
Aux_LED: D302.1 U301.5(GPIO3)
CAM_PWM: U301.6(GPIO4)
CLAW1: U301.7(GPIO5)
CLAW2: U301.8(GPIO6)
Claw_Current: U301.41(GPIO29/ADC3)
Fault_LED: D303.1 U301.4(GPIO2)
MARKER1: U301.9(GPIO7)
MARKER2: U301.11(GPIO8)
SCL: U301.3(GPIO1)
SDA: U301.2(GPIO0)
TORP_ARM: U301.12(GPIO9)
Torp_Charge: U301.40(GPIO28/ADC2)
TORP_COIL1: U301.15(GPIO12)
TORP_COIL2: U301.16(GPIO13)
TORP_COIL3: U301.17(GPIO14)
TORP_SEL1: U301.13(GPIO10)
TORP_SEL2: U301.14(GPIO11)
NetD302_2: D302.2 R304.2
NetD303_2: D303.2 R305.2
NetD304_2: D304.2 R306.2
NetR303_1: R303.1 U301.21(XOUT)

Not connected (* = marked no-connect by the designer): D301 3(LINE2) 4(LINE3); J301 4(ID); U301 18(GPIO15) 27(GPIO16) 28(GPIO17) 29(GPIO18) 30(GPIO19) 31(GPIO20) 32(GPIO21) 34(GPIO22) 35(GPIO23) 36(GPIO24) 37(GPIO25) 38(GPIO26/ADC0) 39(GPIO27/ADC1)

### Layout directives
rule Supply Nets [Voltage = 3.300]: 3V3_MCU
rule Supply Nets [Voltage = 1.100]: 1V1_MCU_Actuator
differential pair; differential pair class USB 2.0: Actuator_USB_N, Actuator_USB_P, Actuator_USB_PIN_N, Actuator_USB_PIN_P

### Notes on the sheet
- Labels drawn without touching a wire or pin: Actuator_XOUT
- DWG. NO.
- REV.
- SHT.
- THIS DOCUMENT AND THE DATA DISCLOSED HEREIN OR HEREWITH IS THE PROPERTY OF ALTIUM LIMITED AND MAY BE FREELY DISTRIBUTED IN WHOLE. NO RIGHTS ARE RESERVED OR EXPRESS OR IMPLIED WARANTEE GIVEN.
- REVISION
- DESCRIPTION
- DATE
- APPROVED
- ENG:
- APPROVALS
- PROJECT
- DSN:
- CHK:
- REFERENCE DOCUMENTS
- PROJECT REVISION:
- TITLE
- DOCUMENT REVISION:
- DESIGN ITEM:
- BOM:
- FAB DWG:
- PCB DWG:
- ASSY DWG:
- SCALE:
- SIZE
- B
- CAGE CODE
- FILE NAME
- DWG NO.
- SHEET
- OF
- REV
- (in symbol Title_Block) Underwater Robotics Team / Ohio State University; Sheet; of

### Library data of the parts
*#3 = Title_Block: as *#1 on sheet CoproMKII_Connectors
C301 = CAPACITOR_10uF_0603: as C103 on sheet CoproMKII_Connectors; ComponentLink1Description: Digikey; ComponentLink1URL: https://www.digikey.com/en/products/detail/samsung-electro-mechanics/CL10A106MQ8NNNC/3886777; Supplier 1: Digi-Key; Supplier Part Number 1: 1276-1119-1-ND; Tolerance: +/- 20%; Voltage: 6.3V
C302-C307 C315 C316 C319 C323 = CAPACITOR_0.1uF_0603: as C101 on sheet CoproMKII_Connectors; ComponentLink1Description: Datsheet; ComponentLink1URL: https://www.mouser.com/datasheet/2/212/KEM_C1002_X7R_SMD-1102033.pdf; Tolerance: +/- 10%; Voltage: 6.3V; Supplier 1: Digi-Key; Supplier Part Number 1: 399-15351-1-ND
C308-C314 C320 C324 = CAPACITOR_1uF_0603: as C102 on sheet CoproMKII_Connectors; Tolerance: +/- 10%; Voltage: 16V; Supplier 1: Digi-Key; Supplier Part Number 1: 399-7847-1-ND
C317 C318 = CAPACITOR_0.000027uF_0603: as C223 on sheet CoproMKII_Coprocessor; ComponentLink1Description: Datsheet; ComponentLink1URL: https://www.mouser.com/datasheet/2/212/KEM_C1002_X7R_SMD-1102033.pdf; Tolerance: +/- 5%; Voltage: 50V; Supplier 1: Digi-Key; Supplier Part Number 1: 311-1063-1-ND
C321 C322 = CAPACITOR_0.01uF_0603: as C245 on sheet CoproMKII_Coprocessor; ComponentLink1Description: Datsheet; ComponentLink1URL: https://www.mouser.com/datasheet/2/212/KEM_C1002_X7R_SMD-1102033.pdf; Voltage: 6.3V; Supplier 1: Mouser; Supplier Part Number 1: 80-C0603C103K9R
D301 = RCLAMP0504S.TCT: as D206 on sheet CoproMKII_Coprocessor; Supplier 1: Digi-Key; Supplier Part Number 1: RCLAMP0504SCT-ND; Clamping Voltage (Max): 25V
D302-D304 = LED_Green_0603_3V: as D201 on sheet CoproMKII_Coprocessor; ComponentLink1Description: Datasheet; ComponentLink1URL: https://www.we-online.de/katalog/datasheet/150060GS75000.pdf; Forward Voltage: 3V; Package: 0603; Supplier 1: Digi-Key; Supplier Part Number 1: 1830-1062-1-ND
J301 = CONN_MICROUSB: as J203 on sheet CoproMKII_Coprocessor; Manufacturer: Amphenol; Configuration: Right Angle; Color: Silver; Created By: Flip B; ComponentLink1Description: Datasheet; ComponentLink1URL: https://cdn.amphenol-icc.com/media/wysiwyg/files/documentation/datasheet/inputoutput/io_usb_micro.pdf?__cf_chl_jschl_tk__=05693735e19256298f6ef6ca2bb2e65c376a4f56-1625503833-0-Abitsb0-ufjOXJYs_S3J3r2iTn-nObalbmXUksF1VvO_h_WEmRdMlUD1I8-hmWSEVWzY1pirKnrPZWfgY3851qyBZe5ZvnNQePLGIzUgdEIQBVUyW36RsbYpDLEWxJ4horD-5gChFgobLYqwmG5aHl0E8lIn_twwPPrOxilK2gP0q9t_CNOs_u5fMqXvXUrlsOv8tIE2NRlu6NVP8qtkL2GjhlkeTUbDMF8WvvpPDTFOgvZ4Y16Ej8F8AhWos88mo5B1HssXozw0XrkJQIqERITUu6rqloz9kf4ZzhBHtDAt-IkiAFY_Ds9SW8FYKKTtINJVpHZQ6Gyu1FFM4Dc9MO0maE8_mmNcwlxqyRoRk_MPWW8VyByXWM5RSp52jteRKw7FeI9WIYvCbPAOy0Eyib-aseIQsnGbglBcUY6_2xp8GYaJM38H3dNvBPsSOfJBPndKedwKHllxjkucXn6xsN0sDXkpGN-cu8_2bDTJ0g-uUucKSCooYX-ApSDNGpkA_p9zv1SOAD8c0zaZVmtiBsN75QpVz2rzq9_BFxOywPvR; Series: 10118192; Supplier 1: Digi-Key; Supplier Part Number 1: 609-4613-1-ND
J302 = HEADER_4PIN_2.54MM: Made By: Robert Pafford; Supplier 1: Digi-Key; Supplier Part Number 1: S1012E-04-ND
J303 = HEADER_2PIN_2.54MM: as J206 on sheet CoproMKII_Coprocessor; Manufacturer: *; Pitch: 2.54mm; Color: Natural; Created By: Robert P; ComponentLink1Description: Datasheet; ComponentLink1URL: https://www.molex.com/pdm_docs/sd/026013115_sd.pdf; Series: *; Supplier 1: Digi-Key; Supplier Part Number 1: A121480-ND; Supplier 2: Mouser; Supplier Part Number 2: 571-5-146280-2
R301 R302 = RESISTOR_27_0603: as R202 on sheet CoproMKII_Coprocessor; ComponentLink1Description: Datasheet; ComponentLink1URL: https://www.bourns.com/docs/product-datasheets/CRxxxxx.pdf; Wattage: 1/8W; Supplier: Digikey; Digikey Part Numer: CR0603-JW-104ELFTR-ND; Supplier 1: Digi-Key; Supplier Part Number 1: 2019-RK73B1JTTD270JCT-ND
R303 R308 = RESISTOR_1K_0603: as R201 on sheet CoproMKII_Coprocessor; ComponentLink1Description: Datasheet; ComponentLink1URL: https://www.bourns.com/docs/product-datasheets/CRxxxxx.pdf; Wattage: 1/8W; Supplier: Digikey; Digikey Part Numer: CR0603-JW-104ELFTR-ND; Supplier 1: Digi-Key; Supplier Part Number 1: 2019-RK73B1JTTD102JCT-ND
R304-R306 = RESISTOR_62_0603: as R206 on sheet CoproMKII_Coprocessor; ComponentLink1Description: Datasheet; ComponentLink1URL: https://www.bourns.com/docs/product-datasheets/CRxxxxx.pdf; Wattage: 1/4W; Supplier: Digikey; Digikey Part Numer: CR0603-JW-104ELFTR-ND; Supplier 1: Digi-Key; Supplier Part Number 1: 541-RCS060362R0FKEACT-ND
R307 R309 = RESISTOR_10K_0603: as R103 on sheet CoproMKII_Connectors; ComponentLink1Description: Datasheet; ComponentLink1URL: https://www.bourns.com/docs/product-datasheets/CRxxxxx.pdf; Supplier: Digikey; Digikey Part Numer: CR0603-JW-104ELFTR-ND; Supplier 1: Digi-Key; Supplier Part Number 1: 2019-RK73B1JTTD103JCT-ND
S301 S302 = Tactile Switch: as S203 on sheet CoproMKII_Coprocessor; Supplier 1: Digi-Key; Supplier Part Number 1: EG2494-ND
U301 = RP2040: as U201 on sheet CoproMKII_Coprocessor; ComponentLink1Description: DigiKey; ComponentLink1URL: *; ComponentLink2Description: Datasheet; ComponentLink2URL: https://datasheets.raspberrypi.org/rp2040/rp2040-datasheet.pdf
U302 = W25Q128JVSIQ: as U202 on sheet CoproMKII_Coprocessor; Supplier 1: Digi-Key; Supplier Part Number 1: W25Q128JVSIQ-ND; Size: 128M
Y301 = CRYSTAL_12MHz_SMD: 12 MHz ±20ppm Crystal 18pF 50 Ohms 4-SMD, No Lead; pin to pad: 2>3 GND>2+4; Made By: Siddharth Venkatesan; Frequency: 25 MHz; ESR: 40 Ohms; Load Capacitance: 18pF; Supplier 1: Digi-Key; Supplier Part Number 1: XC2312CT-ND

## Sheet CoproMKII_Ethernet.SchDoc
size B; SheetNumber: 4; SheetTotal: 4
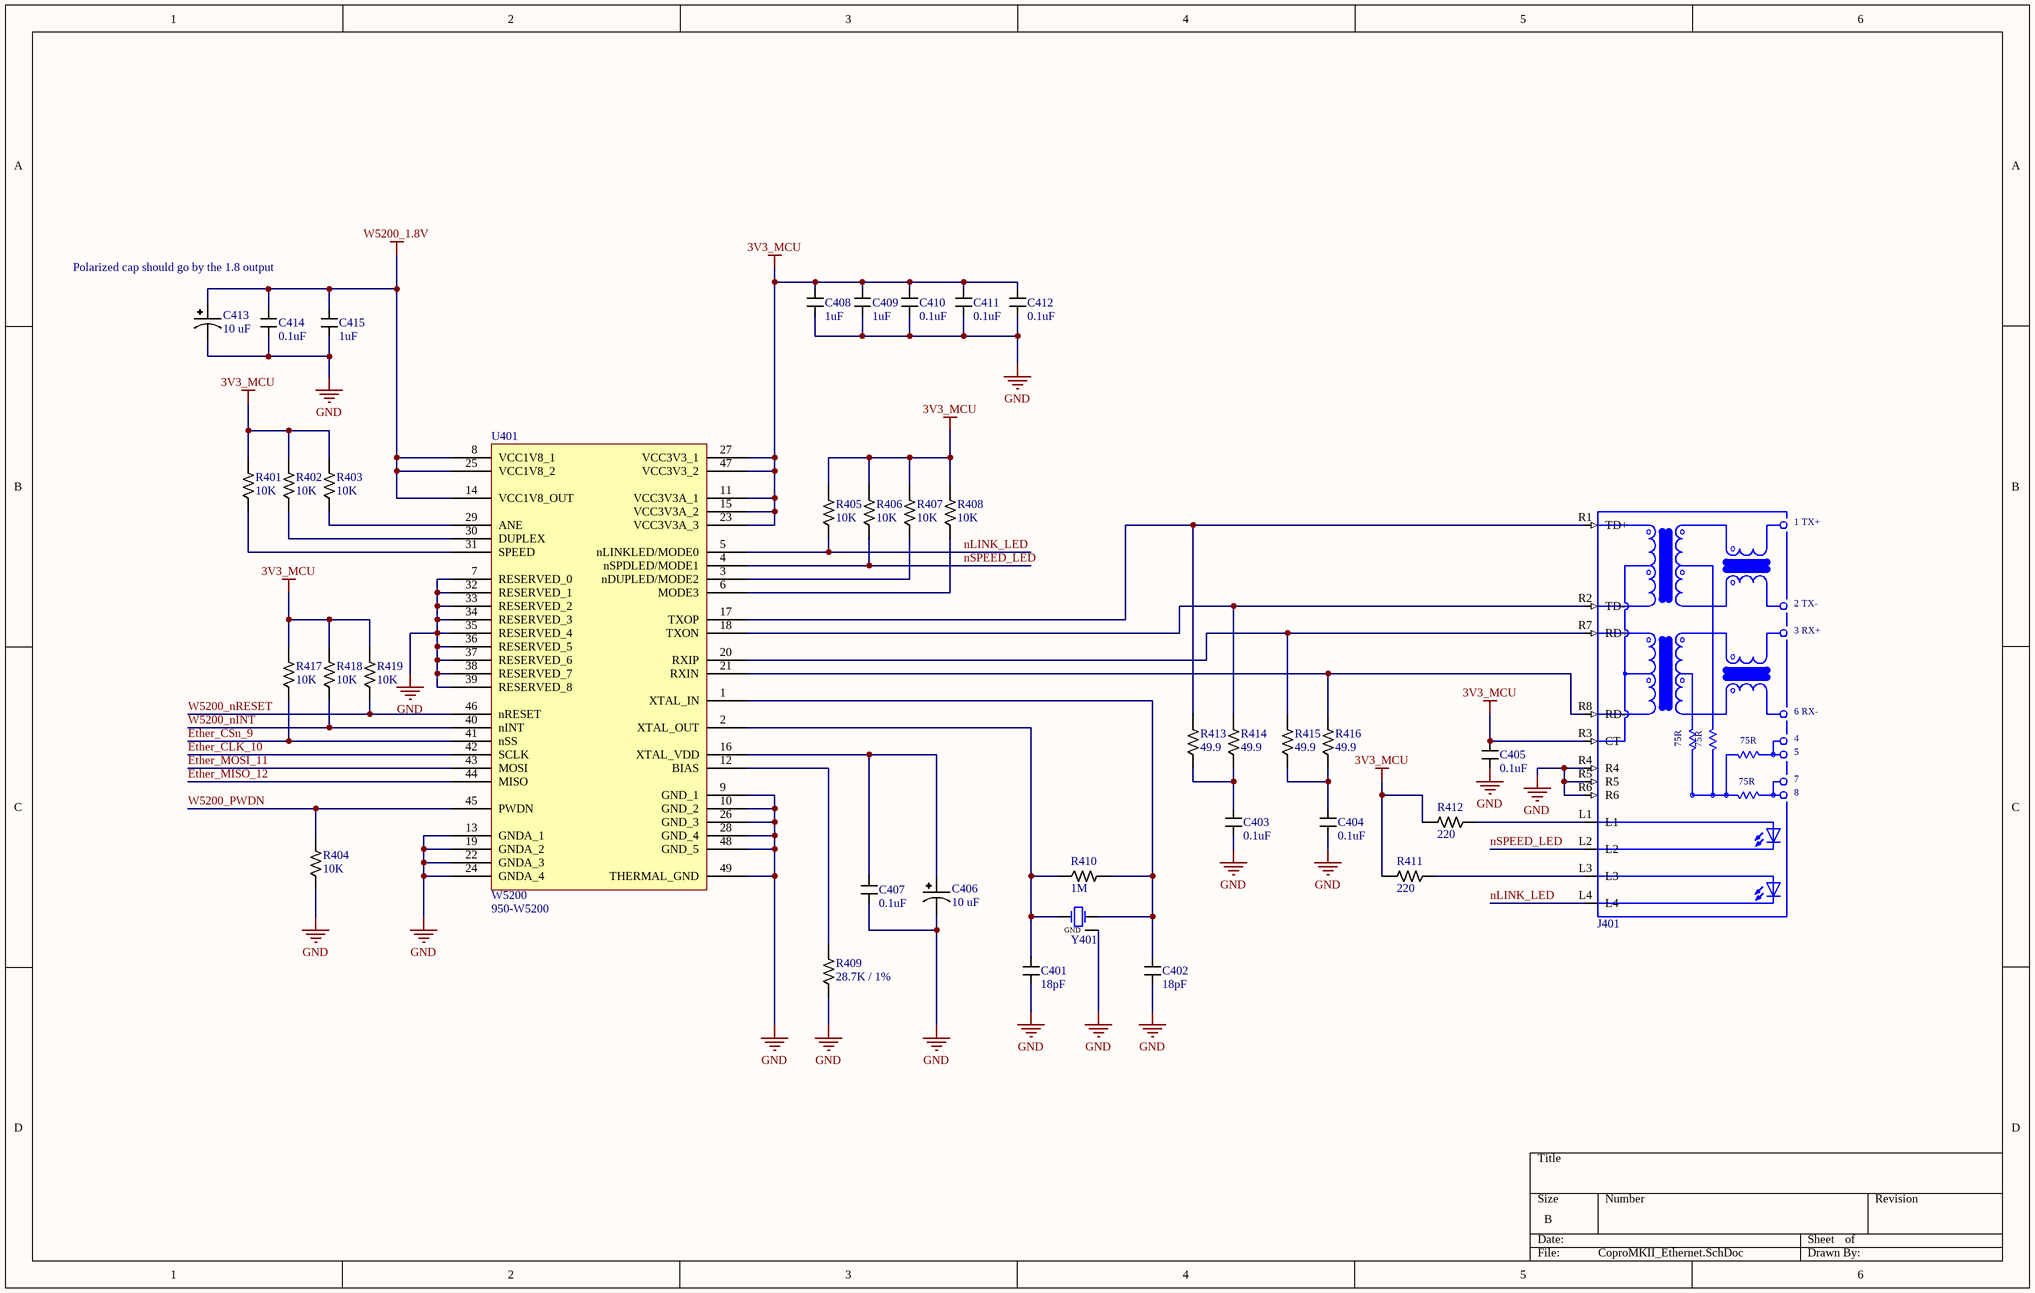
[diagram p3: CoproMKII_Ethernet.SchDoc]

### Parts
C401  value 18pF  [CAPACITOR_0603]  (hidden comment: 18pF Ceramic 50V)
C402  value 18pF  [CAPACITOR_0603]  (hidden comment: 18pF Ceramic 50V)
C403  value 0.1uF  [CAPACITOR_0603]  (hidden comment: 100nF Ceramic 6.3V)
C404  value 0.1uF  [CAPACITOR_0603]  (hidden comment: 100nF Ceramic 6.3V)
C405  value 0.1uF  [CAPACITOR_0603]  (hidden comment: 100nF Ceramic 6.3V)
C406  Value (uF): 10 uF  [CAPACITOR_0603]  (hidden comment: 10uF Tantalum 10V)
C407  value 0.1uF  [CAPACITOR_0603]  (hidden comment: 100nF Ceramic 6.3V)
C408  value 1uF  [CAPACITOR_0603]  (hidden comment: 1uF Ceramic 16V)
C409  value 1uF  [CAPACITOR_0603]  (hidden comment: 1uF Ceramic 16V)
C410  value 0.1uF  [CAPACITOR_0603]  (hidden comment: 100nF Ceramic 6.3V)
C411  value 0.1uF  [CAPACITOR_0603]  (hidden comment: 100nF Ceramic 6.3V)
C412  value 0.1uF  [CAPACITOR_0603]  (hidden comment: 100nF Ceramic 6.3V)
C413  Value (uF): 10 uF  [CAPACITOR_0603]  (hidden comment: 10uF Tantalum 10V)
C414  value 0.1uF  [CAPACITOR_0603]  (hidden comment: 100nF Ceramic 6.3V)
C415  value 1uF  [CAPACITOR_0603]  (hidden comment: 1uF Ceramic 16V)
J401  Ethernet Connector  [WIZNET_RB1-125BAG1A]  (value not drawn)
R401  Value  (Ohms): 10K  [RESISTOR_0603]  (hidden comment: 10k Ohm 5% 1/10W)
R402  Value  (Ohms): 10K  [RESISTOR_0603]  (hidden comment: 10k Ohm 5% 1/10W)
R403  Value  (Ohms): 10K  [RESISTOR_0603]  (hidden comment: 10k Ohm 5% 1/10W)
R404  Value  (Ohms): 10K  [RESISTOR_0603]  (hidden comment: 10k Ohm 5% 1/10W)
R405  Value  (Ohms): 10K  [RESISTOR_0603]  (hidden comment: 10k Ohm 5% 1/10W)
R406  Value  (Ohms): 10K  [RESISTOR_0603]  (hidden comment: 10k Ohm 5% 1/10W)
R407  Value  (Ohms): 10K  [RESISTOR_0603]  (hidden comment: 10k Ohm 5% 1/10W)
R408  Value  (Ohms): 10K  [RESISTOR_0603]  (hidden comment: 10k Ohm 5% 1/10W)
R409  Value  (Ohms): 28.7K / 1%  [RESISTOR_0603]  (hidden comment: K / 1%)
R410  1M  [RESISTOR_0603]
R411  Value  (Ohms): 220  [RESISTOR_0603]  (hidden comment: 220 Ohm 5% 1/8W)
R412  Value  (Ohms): 220  [RESISTOR_0603]  (hidden comment: 220 Ohm 5% 1/8W)
R413  Value  (Ohms): 49.9  [RESISTOR_0603]  (hidden comment: 49.9 Ohm 1% 1/8W)
R414  Value  (Ohms): 49.9  [RESISTOR_0603]  (hidden comment: 49.9 Ohm 1% 1/8W)
R415  Value  (Ohms): 49.9  [RESISTOR_0603]  (hidden comment: 49.9 Ohm 1% 1/8W)
R416  Value  (Ohms): 49.9  [RESISTOR_0603]  (hidden comment: 49.9 Ohm 1% 1/8W)
R417  Value  (Ohms): 10K  [RESISTOR_0603]  (hidden comment: 10k Ohm 5% 1/10W)
R418  Value  (Ohms): 10K  [RESISTOR_0603]  (hidden comment: 10k Ohm 5% 1/10W)
R419  Value  (Ohms): 10K  [RESISTOR_0603]  (hidden comment: 10k Ohm 5% 1/10W)
U401  W5200  Supplier Part Number 1: 950-W5200  [QFN-48]
Y401  CRYSTAL 12.0000MHZ 18PF SMD  [4-SMD No Lead Crystal]  (value not drawn)

### Nets
3V3_MCU: C405.1 C408.1 C409.1 C410.1 C411.1 C412.1 J401.R3(CT) R401.1 R402.1 R403.1 R405.1 R406.1 R407.1 R408.1 R411.1 R412.1 R417.1 R418.1 R419.1 U401.11(VCC3V3A_1) U401.15(VCC3V3A_2) U401.23(VCC3V3A_3) U401.27(VCC3V3_1) U401.47(VCC3V3_2)
GND: C401.2 C402.2 C403.2 C404.2 C405.2 C406.2 C407.2 C408.2 C409.2 C410.2 C411.2 C412.2 C413.2 C414.2 C415.2 J401.R4 J401.R5 J401.R6 R404.2 R409.2 U401.7(RESERVED_0) U401.9(GND_1) U401.10(GND_2) U401.13(GNDA_1) U401.19(GNDA_2) U401.22(GNDA_3) U401.24(GNDA_4) U401.26(GND_3) U401.28(GND_4) U401.32(RESERVED_1) U401.33(RESERVED_2) U401.34(RESERVED_3) U401.35(RESERVED_4) U401.36(RESERVED_5) U401.37(RESERVED_6) U401.38(RESERVED_7) U401.39(RESERVED_8) U401.48(GND_5) U401.49(THERMAL_GND) Y401.GND
W5200_1.8V: C413.1 C414.1 C415.1 U401.8(VCC1V8_1) U401.14(VCC1V8_OUT) U401.25(VCC1V8_2)
Ether_CLK_10: U401.42(SCLK)
Ether_CSn_9: R417.2 U401.41(nSS)
Ether_MISO_12: U401.44(MISO)
Ether_MOSI_11: U401.43(MOSI)
nLINK_LED: J401.L4 R405.2 U401.5(nLINKLED/MODE0)
nSPEED_LED: J401.L2 R406.2 U401.4(nSPDLED/MODE1)
W5200_nINT: R418.2 U401.40(nINT)
W5200_nRESET: R419.2 U401.46(nRESET)
W5200_PWDN: R404.1 U401.45(PWDN)
NetC401_1: C401.1 R410.2 U401.2(XTAL_OUT) Y401.1
NetC402_1: C402.1 R410.1 U401.1(XTAL_IN) Y401.2
NetC403_1: C403.1 R413.2 R414.2
NetC404_1: C404.1 R415.2 R416.2
NetC406_1: C406.1 C407.1 U401.16(XTAL_VDD)
NetJ401_L1: J401.L1 R412.2
NetJ401_L3: J401.L3 R411.2
NetJ401_R1: J401.R1(TD+) R413.1 U401.17(TXOP)
NetJ401_R2: J401.R2(TD-) R414.1 U401.18(TXON)
NetJ401_R7: J401.R7(RD+) R415.1 U401.20(RXIP)
NetJ401_R8: J401.R8(RD-) R416.1 U401.21(RXIN)
NetR401_2: R401.2 U401.31(SPEED)
NetR402_2: R402.2 U401.30(DUPLEX)
NetR403_2: R403.2 U401.29(ANE)
NetR407_2: R407.2 U401.3(nDUPLED/MODE2)
NetR408_2: R408.2 U401.6(MODE3)
NetR409_1: R409.1 U401.12(BIAS)

### Notes on the sheet
- Polarized cap should go by the 1.8 output
- (in symbol RB1-125BAG1A) 1 TX+; 2 TX-; 3 RX+; 6 RX-; 75R; 4; 5; 7; 8

### Library data of the parts
C401 C402 = CAPACITOR_0.000018uF_0603: Cap 18pF 50V +/-5% / Ceramic 0603; Made By: Flip B; ComponentLink1Description: Datsheet; ComponentLink1URL: https://www.mouser.com/datasheet/2/212/KEM_C1002_X7R_SMD-1102033.pdf; Tolerance: +/- 5%; Voltage: 50V; Supplier 1: Digi-Key; Supplier Part Number 1: 311-1061-1-ND
C403-C405 C407 C410-C412 C414 = CAPACITOR_0.1uF_0603: as C101 on sheet CoproMKII_Connectors; ComponentLink1Description: Datsheet; ComponentLink1URL: https://www.mouser.com/datasheet/2/212/KEM_C1002_X7R_SMD-1102033.pdf; Tolerance: +/- 10%; Voltage: 6.3V; Supplier 1: Digi-Key; Supplier Part Number 1: 399-15351-1-ND
C406 C413 = CAPACITOR_10uF_0603_Tantalum: Cap 10uF 10V +/-20% / Tantalum 0603; Made By: John S; ComponentLink1Description: Digikey; ComponentLink1URL: https://www.digikey.com/en/products/detail/kyocera-avx/F981A106MMA/4004990; Tolerance: +/- 20%; Voltage: 10V
C408 C409 C415 = CAPACITOR_1uF_0603: as C102 on sheet CoproMKII_Connectors; Tolerance: +/- 10%; Voltage: 16V; Supplier 1: Digi-Key; Supplier Part Number 1: 399-7847-1-ND
J401 = RB1-125BAG1A: CONN JACK 1PORT 100 BASE-T PCB
R401-R408 R417-R419 = RESISTOR_10K_0603: as R103 on sheet CoproMKII_Connectors; ComponentLink1Description: Datasheet; ComponentLink1URL: https://www.bourns.com/docs/product-datasheets/CRxxxxx.pdf; Supplier: Digikey; Digikey Part Numer: CR0603-JW-104ELFTR-ND; Supplier 1: Digi-Key; Supplier Part Number 1: 2019-RK73B1JTTD103JCT-ND
R409 = RESISTOR_28.7K / 1%_0603: RES 28.7K OHM 1% 1/8W 0603; Tolerance: +/- 5%; Made By: Robert Pafford; ComponentLink1Description: Datasheet; ComponentLink1URL: https://www.bourns.com/docs/product-datasheets/CRxxxxx.pdf; Wattage: 1/8W; Supplier: Digikey; Digikey Part Numer: CR0603-JW-104ELFTR-ND; Supplier 1: Digi-Key; Supplier Part Number 1: 541-28.7KHCT-ND
R410 = RESISTOR_1M_0603: RES 1M OHM 1/8W 0603; Tolerance: +/- 5%; Made By: Robert Pafford; ComponentLink1Description: Datasheet; ComponentLink1URL: https://www.bourns.com/docs/product-datasheets/CRxxxxx.pdf; Wattage: 1/8W; Supplier: Digikey; Digikey Part Numer: CR0603-JW-104ELFTR-ND; Supplier 1: Digi-Key; Supplier Part Number 1: RMCF0603JT1M00CT-ND; Value  (Ohms): 1M
R411 R412 = RESISTOR_200_0603: RES 220 OHM 5% 1/8W 0603; Tolerance: +/- 5%; Made By: John S; ComponentLink1Description: Digikey; ComponentLink1URL: https://www.digikey.com/en/products/detail/koa-speer-electronics-inc/RK73B1JTTD101J/9844701; Wattage: 1/8W; Supplier 1: Digi-Key; Supplier Part Number 1: 2019-RK73B1JTTD221JCT-ND
R413-R416 = RESISTOR_49.9_0603: RES 49.9 OHM 1% 1/8W 0603; Tolerance: +/- 1%; Made By: John S; ComponentLink1Description: Datasheet; ComponentLink1URL: https://www.bourns.com/docs/product-datasheets/CRxxxxx.pdf; Wattage: 1/8W; Supplier: Digikey; Supplier 1: Digi-Key; Supplier Part Number 1: RNCP0603FTD49R9CT-ND
U401 = W5200: WIZNET W5200 / 48QFN (7x7 mm); MF: Texas Instruments; MP: LM1117IMPX-3.3/NOPB; Created by:: Siddharth.V; Texas_Instruments-Purchase-URL: https://snapeda.com/shop?store=Texas+Instruments&id=410186; Price: None; Mouser-Purchase-URL: https://snapeda.com/shop?store=Mouser&id=410186; Value: *; Availability: Good; Package: SOT-223-4 Texas Instruments; Arrow_Electronics-Purchase-URL: https://snapeda.com/shop?store=Arrow+Electronics&id=410186; SnapEDA_Link: https://www.snapeda.com/parts/LM1117IMPX-3.3/NOPB/Texas%20Instruments/view-part/410186/?ref=snap; DigiKey-Purchase-URL: https://snapeda.com/shop?store=DigiKey&id=410186; ComponentLink1Description: Datasheet; ComponentLink1URL: https://www.wiznet.io/product-item/w5200/; Supplier 1: Mouser
Y401 = CRYSTAL_25MHz_SMD_1: 25 MHz ±20ppm Crystal 18pF; pin to pad: 2>3 GND>2+4; Made By: Robert Pafford; Frequency: 12 MHz; ESR: 50 Ohmz; Load Capacitance: 18pF; Supplier 1: Digi-Key; Supplier Part Number 1: 2151-AS-25.000-18-F-EXT-ND

## Nets that join several sheets
3V3_MCU: CoproMKII_Connectors (30 pins), CoproMKII_Coprocessor (31 pins), CoproMKII_Actuator (31 pins), CoproMKII_Ethernet (24 pins)
5V: CoproMKII_Connectors (13 pins), CoproMKII_Coprocessor (J206.1), CoproMKII_Actuator (J303.1)
GND: CoproMKII_Connectors (29 pins), CoproMKII_Coprocessor (41 pins), CoproMKII_Actuator (42 pins), CoproMKII_Ethernet (40 pins)
AUX_SWITCH: CoproMKII_Connectors (J101.6), CoproMKII_Coprocessor (U201.5)
CAM_PWM: CoproMKII_Connectors (J103.2), CoproMKII_Actuator (U301.6)
CLAW1: CoproMKII_Connectors (J103.3), CoproMKII_Actuator (U301.7)
CLAW2: CoproMKII_Connectors (J103.4), CoproMKII_Actuator (U301.8)
ESC_TELEM: CoproMKII_Connectors (J102.10), CoproMKII_Coprocessor (U201.36)
Ether_CLK_10: CoproMKII_Coprocessor (U201.17), CoproMKII_Ethernet (U401.42)
Ether_MISO_12: CoproMKII_Coprocessor (U201.15), CoproMKII_Ethernet (U401.44)
Ether_MOSI_11: CoproMKII_Coprocessor (U201.18), CoproMKII_Ethernet (U401.43)
KILL_SWITCH: CoproMKII_Connectors (J101.5), CoproMKII_Coprocessor (U201.4)
LIGHTING_1: CoproMKII_Connectors (J101.9), CoproMKII_Coprocessor (U201.11)
LIGHTING_2: CoproMKII_Connectors (J101.10), CoproMKII_Coprocessor (U201.12)
MARKER1: CoproMKII_Connectors (J103.5), CoproMKII_Actuator (U301.9)
MARKER2: CoproMKII_Connectors (J103.6), CoproMKII_Actuator (U301.11)
PWM1: CoproMKII_Connectors (J102.2 R104.2 U103.3), CoproMKII_Coprocessor (U201.27)
PWM2: CoproMKII_Connectors (J102.3 R106.2 U104.3), CoproMKII_Coprocessor (U201.29)
PWM3: CoproMKII_Connectors (J102.4 R108.2 U105.3), CoproMKII_Coprocessor (U201.31)
PWM4: CoproMKII_Connectors (J102.5 R110.2 U106.3), CoproMKII_Coprocessor (U201.34)
PWM5: CoproMKII_Connectors (J102.6 R112.2 U107.3), CoproMKII_Coprocessor (U201.35)
PWM6: CoproMKII_Connectors (J102.7 R114.2 U108.3), CoproMKII_Coprocessor (U201.32)
PWM7: CoproMKII_Connectors (J102.8 R116.2 U109.3), CoproMKII_Coprocessor (U201.30)
PWM8: CoproMKII_Connectors (J102.9 R118.2 U110.3), CoproMKII_Coprocessor (U201.28)
PWR_MOBO: CoproMKII_Connectors (J101.4), CoproMKII_Coprocessor (U201.3)
PWR_PLTR: CoproMKII_Connectors (J101.3), CoproMKII_Coprocessor (U201.2)
SCL: CoproMKII_Connectors (J101.11 R102.2 U102.4 U111.2), CoproMKII_Coprocessor (U201.14), CoproMKII_Actuator (U301.3)
SDA: CoproMKII_Connectors (J101.12 R101.2 U102.1 U111.4), CoproMKII_Coprocessor (U201.13), CoproMKII_Actuator (U301.2)
TORP_ARM: CoproMKII_Connectors (J103.7), CoproMKII_Actuator (U301.12)
TORP_COIL1: CoproMKII_Connectors (J103.10), CoproMKII_Actuator (U301.15)
TORP_COIL2: CoproMKII_Connectors (J103.11), CoproMKII_Actuator (U301.16)
TORP_COIL3: CoproMKII_Connectors (J103.12), CoproMKII_Actuator (U301.17)
TORP_SEL1: CoproMKII_Connectors (J103.8), CoproMKII_Actuator (U301.13)
TORP_SEL2: CoproMKII_Connectors (J103.9), CoproMKII_Actuator (U301.14)
W5200_nRESET: CoproMKII_Coprocessor (U201.16), CoproMKII_Ethernet (R419.2 U401.46)